# Altium project BraaiBuddyPCB.PrjPcb (part 1 of 2)
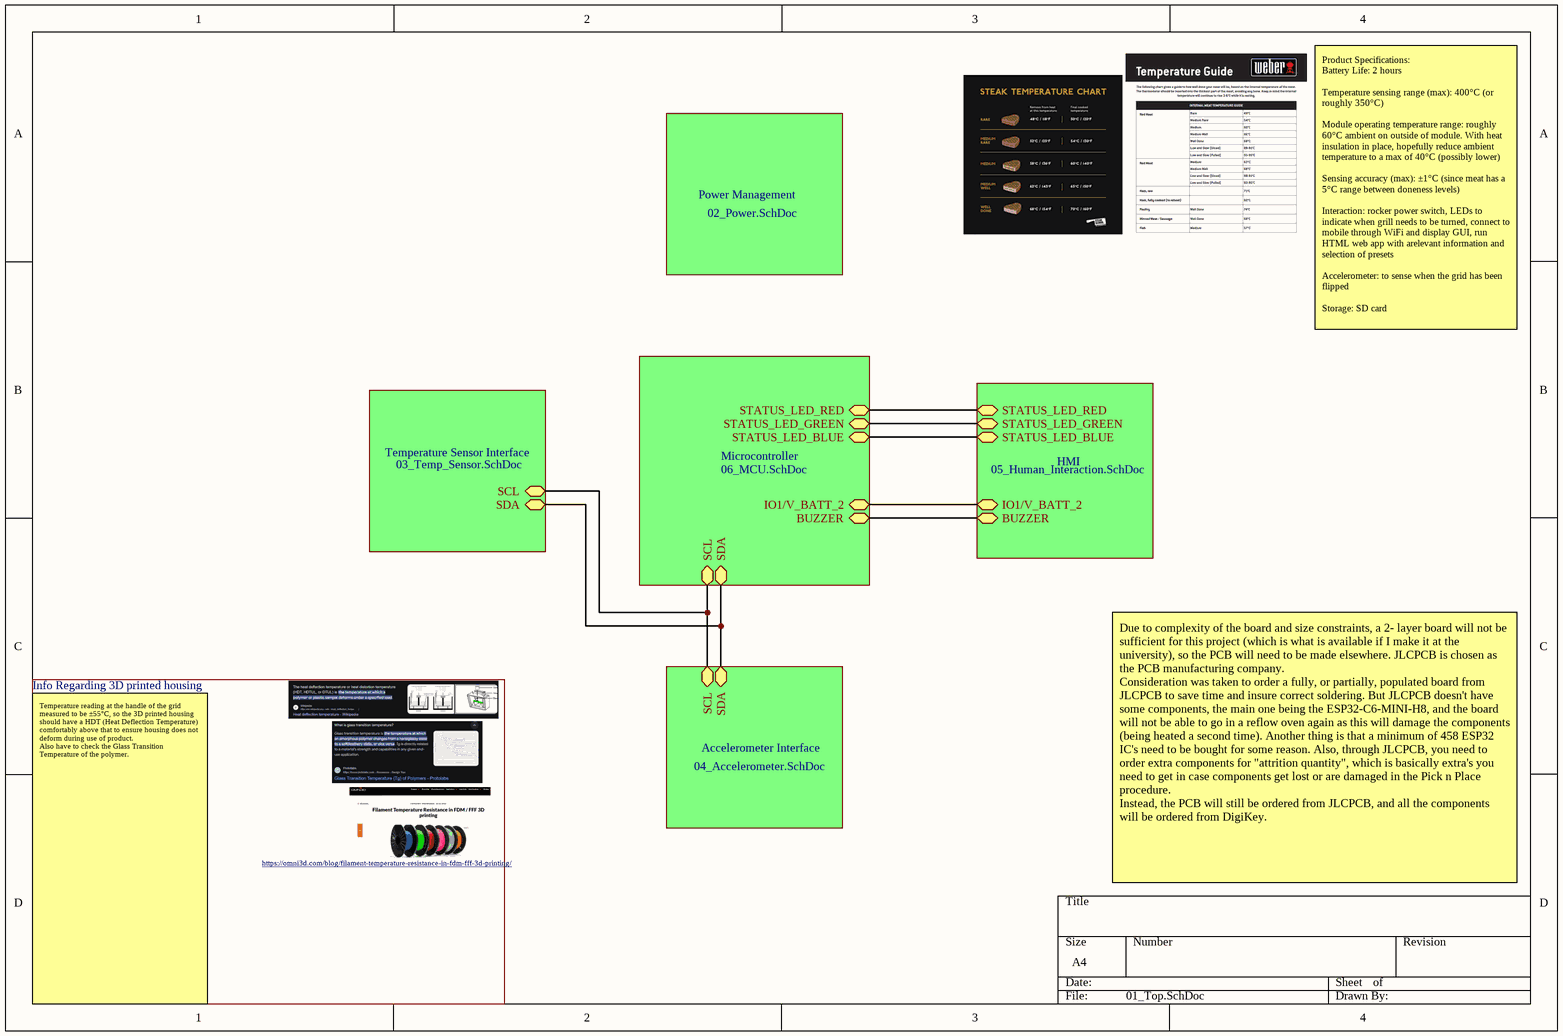
[diagram p0: 01_Top.SchDoc]
my_name: Estiaan Botha
9 sheets, 239 parts. Net scope: hierarchical (ports join the sheet entries above them; power ports are global).
Board file: PCB.PcbDoc
Sheets:
  01_Top.SchDoc
    Microcontroller = 06_MCU.SchDoc
    Temperature Sensor Interface = 03_Temp_Sensor.SchDoc
      U_04.1_Temp_Sensor_Info = 04.1_Temp_Sensor_Info.SchDoc
      Temp_Handling_ CH1 = 04.2_Thermocouple_Handling_01.SchDoc
      Temp_Handling_ CH2 = 04.2_Thermocouple_Handling_01.SchDoc
      Temp_Handling_ CH3 = 04.2_Thermocouple_Handling_01.SchDoc
      Temp_Handling_ CH4 = 04.2_Thermocouple_Handling_01.SchDoc
      Temp_Handling_ CH5 = 04.2_Thermocouple_Handling_01.SchDoc
    Accelerometer Interface = 04_Accelerometer.SchDoc
    Power Management = 02_Power.SchDoc
    HMI = 05_Human_Interaction.SchDoc
  Schematic.SchDoc
    Temp_Handling_ CH1 = 04.2_Thermocouple_Handling_01.SchDoc
    Temp_Handling_ CH2 = 04.2_Thermocouple_Handling_01.SchDoc
    Temp_Handling_ CH3 = 04.2_Thermocouple_Handling_01.SchDoc
    Temp_Handling_ CH4 = 04.2_Thermocouple_Handling_01.SchDoc
    Temp_Handling_ CH5 = 04.2_Thermocouple_Handling_01.SchDoc

## Sheet 01_Top.SchDoc
size A4; SheetNumber: 1; SheetTotal: 8

### Sub-sheets
Accelerometer Interface = 04_Accelerometer.SchDoc: SCL (bidir), SDA (bidir)
HMI = 05_Human_Interaction.SchDoc: STATUS_LED_RED (bidir), STATUS_LED_GREEN (bidir), STATUS_LED_BLUE (bidir), IO1/V_BATT_2 (bidir), BUZZER (bidir)
Microcontroller = 06_MCU.SchDoc: SCL (bidir), SDA (bidir), IO1/V_BATT_2 (bidir), STATUS_LED_RED (bidir), STATUS_LED_GREEN (bidir), STATUS_LED_BLUE (bidir), BUZZER (bidir)
Power Management = 02_Power.SchDoc: no entries
Temperature Sensor Interface = 03_Temp_Sensor.SchDoc: SCL (bidir), SDA (bidir)

### Nets
IO6/SDA: sheet Microcontroller/SDA, sheet Temperature Sensor Interface/SDA, sheet Accelerometer Interface/SDA
IO7/SCL: sheet Microcontroller/SCL, sheet Temperature Sensor Interface/SCL, sheet Accelerometer Interface/SCL
IO14: sheet Microcontroller/BUZZER, sheet HMI/BUZZER
NetR13#1_2: sheet Microcontroller/STATUS_LED_GREEN, sheet HMI/STATUS_LED_GREEN
NetR14#1_2: sheet Microcontroller/STATUS_LED_RED, sheet HMI/STATUS_LED_RED
NetR15#1_2: sheet Microcontroller/STATUS_LED_BLUE, sheet HMI/STATUS_LED_BLUE
NetR16#1_1: sheet Microcontroller/IO1/V_BATT_2, sheet HMI/IO1/V_BATT_2

### Notes on the sheet
- Product Specifications:
  Battery Life: 2 hours
  Temperature sensing range (max): 400°C (or roughly 350°C)
  Module operating temperature range: roughly 60°C ambient on outside of module. With heat insulation in place, hopefully reduce ambient temperature to a max of 40°C (possibly lower)
  Sensing accuracy (max): ±1°C (since meat has a 5°C range between doneness levels)
  Interaction: rocker power switch, LEDs to indicate when grill needs to be turned, connect to mobile through WiFi and display GUI, run HTML web app with arelevant information and selection of presets
  Accelerometer: to sense when the grid has been flipped
  Storage: SD card
- Info Regarding 3D printed housing
- https://omni3d.com/blog/filament-temperature-resistance-in-fdm-fff-3d-printing/
- Due to complexity of the board and size constraints, a 2- layer board will not be sufficient for this project (which is what is available if I make it at the university), so the PCB will need to be made elsewhere. JLCPCB is chosen as the PCB manufacturing company.
  Consideration was taken to order a fully, or partially, populated board from JLCPCB to save time and insure correct soldering. But JLCPCB doesn't have some components, the main one being the ESP32-C6-MINI-H8, and the board will not be able to go in a reflow oven again as this will damage the components (being heated a second time). Another thing is that a minimum of 458 ESP32 IC's need to be bought for some reason. Also, through JLCPCB, you need to order extra components for "attrition quantity", which is basically extra's you need to get in case components get lost or are damaged in the Pick n Place procedure.
  Instead, the PCB will still be ordered from JLCPCB, and all the components will be ordered from DigiKey.
- Temperature reading at the handle of the grid measured to be ±55°C, so the 3D printed housing should have a HDT (Heat Deflection Temperature) comfortably above that to ensure housing does not deform during use of product.
  Also have to check the Glass Transition Temperature of the polymer.

## Sheet 06_MCU.SchDoc
size 431 x 279 mm; Author: Estiaan Botha; SheetNumber: 8; SheetTotal: 9; ENG_APP_DATE: --/--/--; DSN_APP_DATE: --/--/--; CHK_APP_DATE: --/--/--
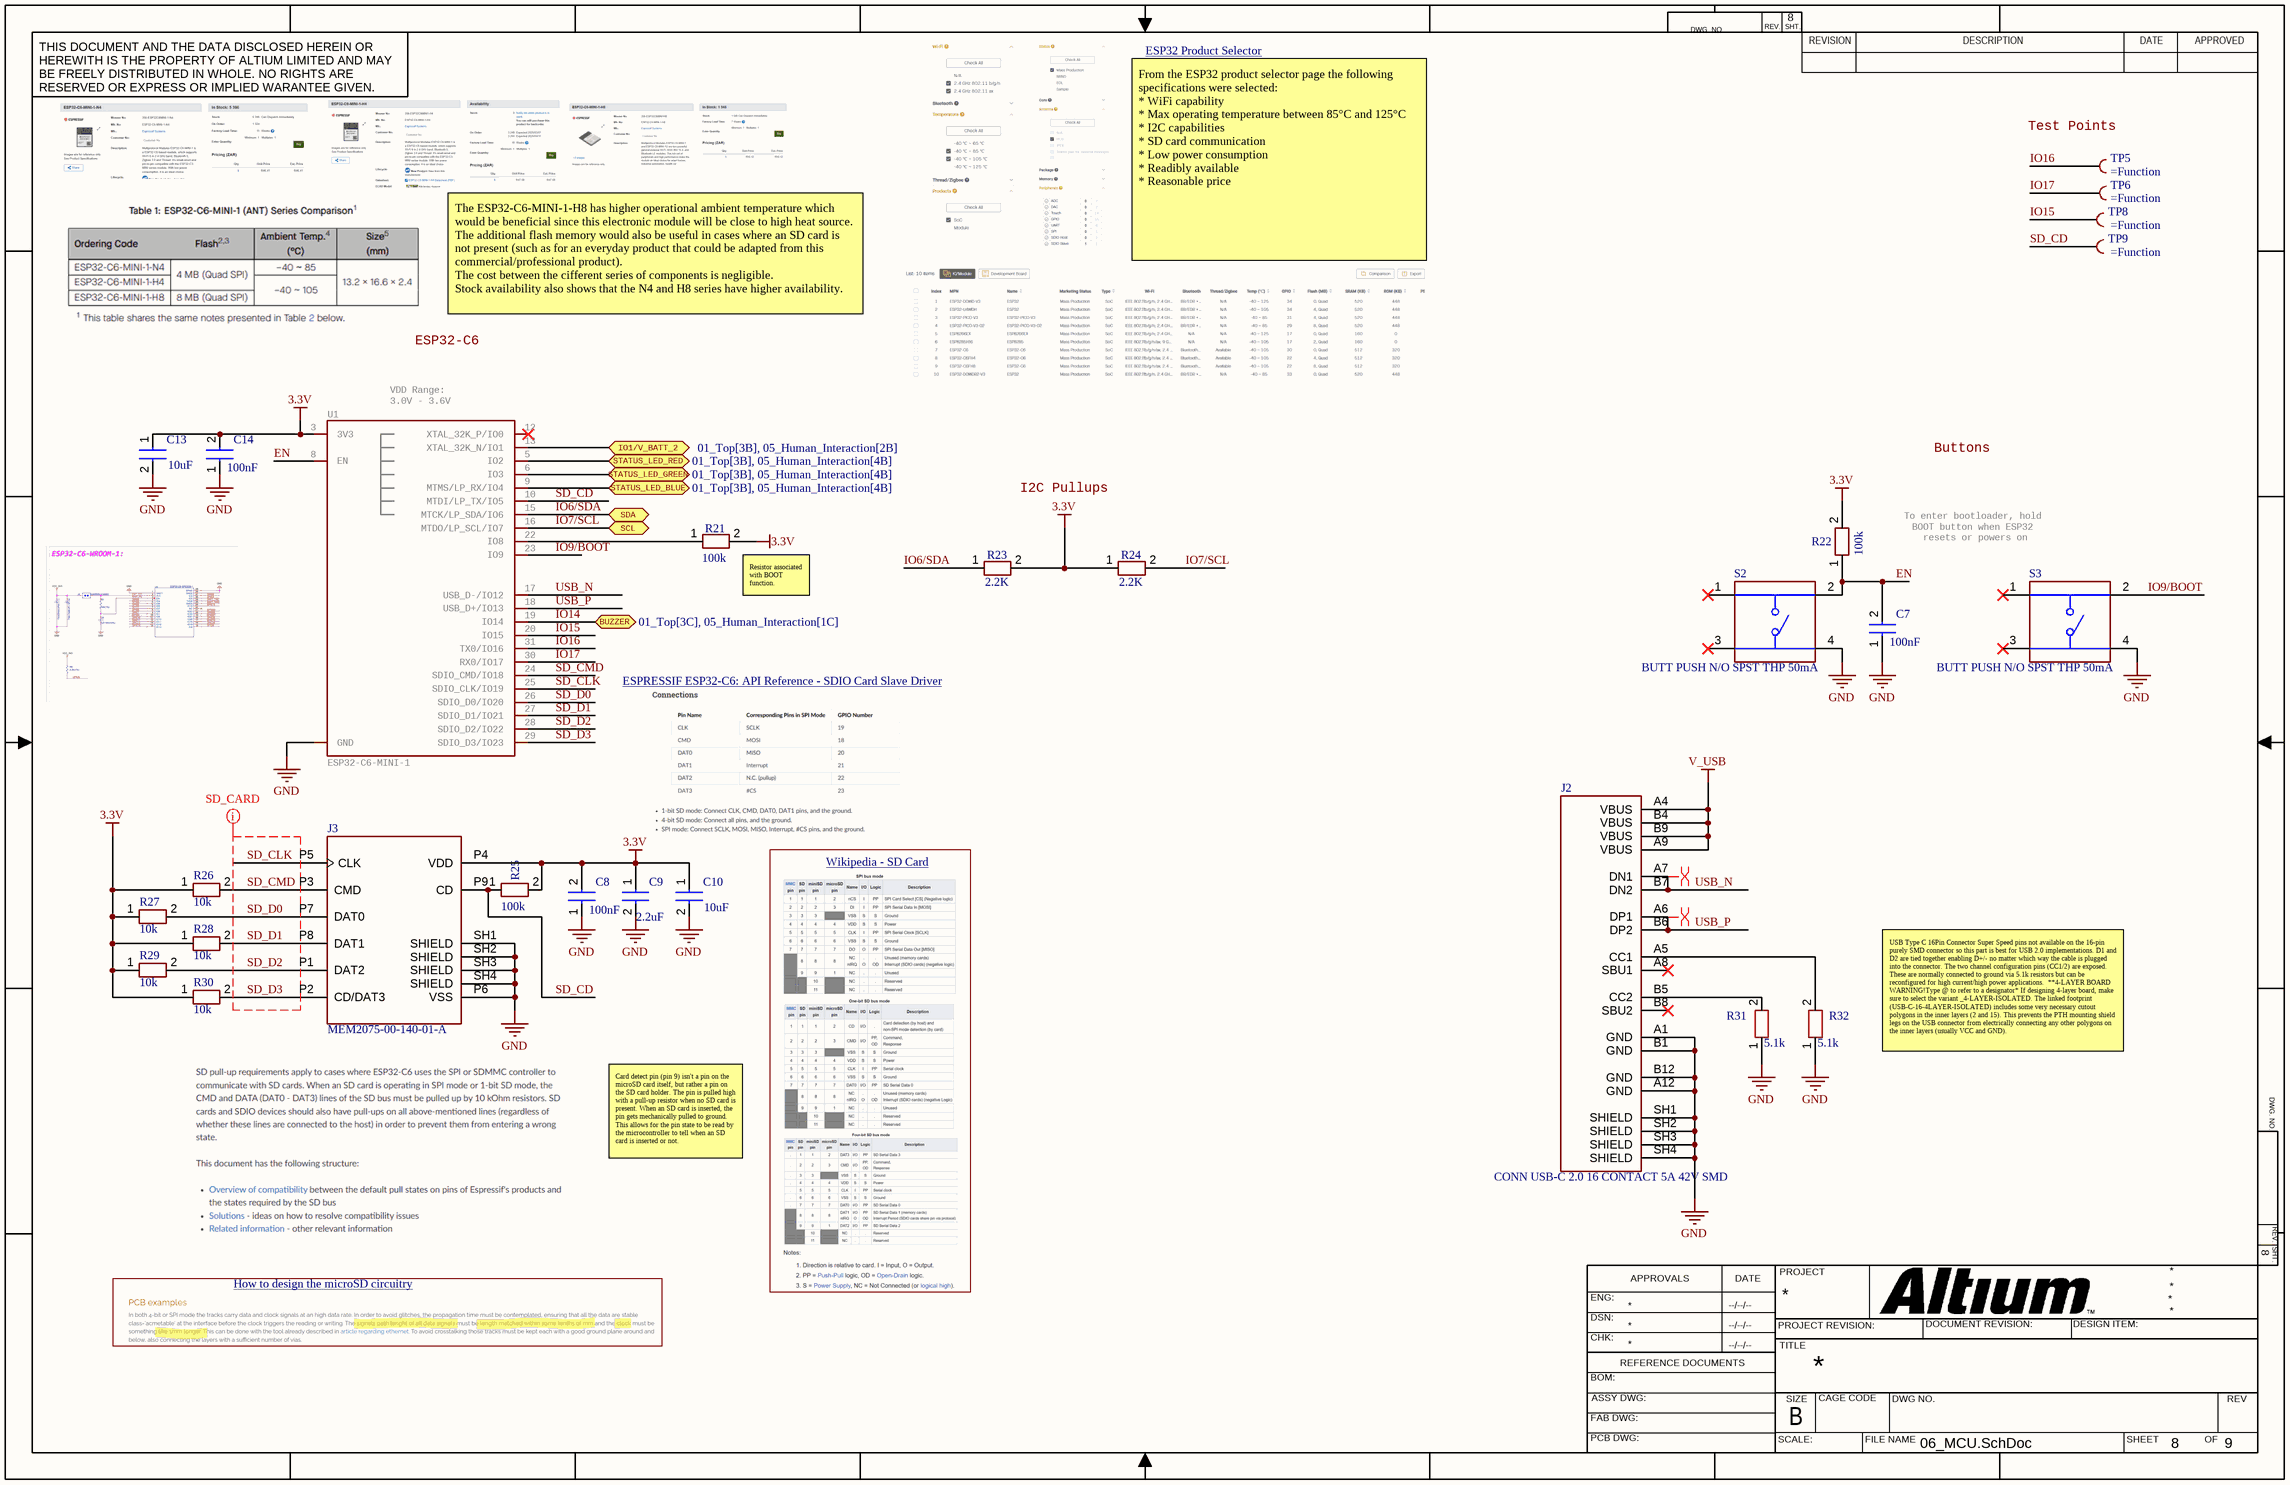
[diagram p1: 06_MCU.SchDoc]

### Parts
(Parts that share a designator on the sheet are numbered #1, #2 ... from top to bottom, then left to right.)
C7#1  100nF  [CAPC2012X94N]
C8#1  100nF  [CAPC2012X94N]
C9#1  2.2uF  [CAPC2012X135N]
C10#1  10uF  [CAPC2012X94N]
C13#1  10uF  [CAPC2012X94N]
C14#1  100nF  [CAPC2012X94N]
J2#1  CONN USB-C 2.0 16 CONTACT 5A 42V SMD  [CUI_UJ20-C-H-G-SMT-TR]
J3#1  MEM2075-00-140-01-A  [GCT_MEM2075-00-140-01-A]
R21#1  100k  [RESC2012X50N]
R22#1  100k  [RESC2012X50N]
R23#1  2.2K  [RESC2012X70N]
R24#1  2.2K  [RESC2012X70N]
R25#1  100k  [RESC2012X50N]
R26#1  10k  [RESC2012X60N]
R27#1  10k  [RESC2012X60N]
R28#1  10k  [RESC2012X60N]
R29#1  10k  [RESC2012X60N]
R30#1  10k  [RESC2012X60N]
R31#1  5.1k  [RESC2012X60N]
R32#1  5.1k  [RESC2012X60N]
S2#1  BUTT PUSH N/O SPST THP 50mA  [SW_TS02-66-43-BK-100-LCR-D]
S3#1  BUTT PUSH N/O SPST THP 50mA  [SW_TS02-66-43-BK-100-LCR-D]
TP5#1  (no value)  [TP_Pad_TH_1.2P_0.6H]  (no BOM)
TP6#1  (no value)  [TP_Pad_TH_1.2P_0.6H]  (no BOM)
TP8#1  (no value)  [TP_Pad_TH_1.2P_0.6H]  (no BOM)
TP9#1  (no value)  [TP_Pad_TH_1.2P_0.6H]  (no BOM)
U1#1  ESP32-C6-MINI-1  [ESP32C6MINI1H8]

### Ports
BUZZER (bidir, see 01_Top[3C], 05_Human_Interaction[1C]), IO1/V_BATT_2 (bidir, see 01_Top[3B], 05_Human_Interaction[2B]), SCL (bidir, see 01_Top[2C], 03_Temp_Sensor[4B], 04.2_Thermocouple_Handling_01[2B], 04_Accelerometer[3B]), SDA (bidir, see 01_Top[2C], 03_Temp_Sensor[4B], 04.2_Thermocouple_Handling_01[2B], 04_Accelerometer[3C]), STATUS_LED_BLUE (bidir, see 01_Top[3B], 05_Human_Interaction[4B]), STATUS_LED_GREEN (bidir, see 01_Top[3B], 05_Human_Interaction[4B]), STATUS_LED_RED (bidir, see 01_Top[3B], 05_Human_Interaction[4B])

### Nets
3.3V: C8#1.2 C9#1.1 C10#1.1 C13#1.1 C14#1.2 J3#1.P4(VDD) R21#1.2 R22#1.2 R23#1.2 R24#1.1 R25#1.2 R26#1.1 R27#1.1 R28#1.1 R29#1.1 R30#1.1 U1#1.3(3V3)
GND: C7#1.1 C8#1.1 C9#1.2 C10#1.2 C13#1.2 C14#1.1 J2#1.A1(GND) J2#1.A12(GND) J2#1.B1(GND) J2#1.B12(GND) J2#1.SH1(SHIELD) J2#1.SH2(SHIELD) J2#1.SH3(SHIELD) J2#1.SH4(SHIELD) J3#1.P6(VSS) J3#1.SH1(SHIELD) J3#1.SH2(SHIELD) J3#1.SH3(SHIELD) J3#1.SH4(SHIELD) R31#1.1 R32#1.1 S2#1.4 S3#1.4 U1#1.1(GND)
V_USB: J2#1.A4(VBUS) J2#1.A9(VBUS) J2#1.B4(VBUS) J2#1.B9(VBUS)
EN: C7#1.2 R22#1.1 S2#1.2 U1#1.8(EN)
IO6/SDA: R23#1.1 U1#1.15(MTCK/LP_SDA/IO6) ; port SDA
IO7/SCL: R24#1.2 U1#1.16(MTDO/LP_SCL/IO7) ; port SCL
IO9/BOOT: S3#1.2 U1#1.23(IO9)
IO14: U1#1.19(IO14) ; port BUZZER
IO15: TP8#1.TP U1#1.20(IO15)
IO16: TP5#1.TP U1#1.31(TX0/IO16)
IO17: TP6#1.TP U1#1.30(RX0/IO17)
SD_CD: J3#1.P9(CD) R25#1.1 TP9#1.TP U1#1.10(MTDI/LP_TX/IO5)
SD_CLK: J3#1.P5(CLK) U1#1.25(SDIO_CLK/IO19)
SD_CMD: J3#1.P3(CMD) R26#1.2 U1#1.24(SDIO_CMD/IO18)
SD_D0: J3#1.P7(DAT0) R27#1.2 U1#1.26(SDIO_D0/IO20)
SD_D1: J3#1.P8(DAT1) R28#1.2 U1#1.27(SDIO_D1/IO21)
SD_D2: J3#1.P1(DAT2) R29#1.2 U1#1.28(SDIO_D2/IO22)
SD_D3: J3#1.P2(CD/DAT3) R30#1.2 U1#1.29(SDIO_D3/IO23)
USB_N: J2#1.A7(DN1) J2#1.B7(DN2) U1#1.17(USB_D-/IO12)
USB_P: J2#1.A6(DP1) J2#1.B6(DP2) U1#1.18(USB_D+/IO13)
NetJ2#1_A5: J2#1.A5(CC1) R32#1.2
NetJ2#1_B5: J2#1.B5(CC2) R31#1.2
NetR13#1_2: U1#1.6(IO3) ; port STATUS_LED_GREEN
NetR14#1_2: U1#1.5(IO2) ; port STATUS_LED_RED
NetR15#1_2: U1#1.9(MTMS/LP_RX/IO4) ; port STATUS_LED_BLUE
NetR16#1_1: U1#1.13(XTAL_32K_N/IO1) ; port IO1/V_BATT_2
NetR21#1_1: R21#1.1 U1#1.22(IO8)

Not connected (* = marked no-connect by the designer): J2#1 A8(SBU1)* B8(SBU2)*; S2#1 1* 3*; S3#1 1* 3*; U1#1 12(XTAL_32K_P/IO0)*

### Layout directives
differential pair: USB_N, USB_P
net class SD Card: SD_CLK, SD_CMD, SD_D0, SD_D1, SD_D2, SD_D3

### Notes on the sheet
- ESP32 Product Selector <https://products.espressif.com/#/product-selector?names=>
- (near TP5#1) Test Points
- From the ESP32 product selector page the following specifications were selected:
  * WiFi capability
  * Max operating temperature between 85°C and 125°C
  * I2C capabilities
  * SD card communication
  * Low power consumption
  * Readibly available
  * Reasonable price
- ESP32-C6
- The ESP32-C6-MINI-1-H8 has higher operational ambient temperature which would be beneficial since this electronic module will be close to high heat source. The additional flash memory would also be useful in cases where an SD card is not present (such as for an everyday product that could be adapted from this commercial/professional product).
  The cost between the cifferent series of components is negligible.
  Stock availability also shows that the N4 and H8 series have higher availability.
- (near U1#1) VDD Range:
  3.0V - 3.6V
- I2C Pullups
- Buttons
- To enter bootloader, hold
  BOOT button when ESP32
  resets or powers on
- (near R21#1) Resistor associated with BOOT function.
- ESPRESSIF ESP32-C6: API Reference - SDIO Card Slave Driver <https://docs.espressif.com/projects/esp-idf/en/v5.2.4/esp32c6/api-reference/peripherals/sdio_slave.html>
- Wikipedia - SD Card <https://en.wikipedia.org/wiki/SD_card#Technical_details>
- USB Type C 16Pin Connector Super Speed pins not available on the 16-pin purely SMD connector so this part is best for USB 2.0 implementations. D1 and D2 are tied together enabling D+/- no matter which way the cable is plugged into the connector. The two channel configuration pins (CC1/2) are exposed. These are normally connected to ground via 5.1k resistors but can be reconfigured for high current/high power applications.  **4-LAYER BOARD WARNING!Type @ to refer to a designator* If designing 4-layer board, make sure to select the variant _4-LAYER-ISOLATED. The linked footprint (USB-C-16-4LAYER-ISOLATED) includes some very necessary cutout polygons in the inner layers (2 and 15). This prevents the PTH mounting shield legs on the USB connector from electrically connecting any other polygons on the inner layers (usually VCC and GND).
- Card detect pin (pin 9) isn't a pin on the microSD card itself, but rather a pin on the SD card holder. The pin is pulled high with a pull-up resistor when no SD card is present. When an SD card is inserted, the pin gets mechanically pulled to ground. This allows for the pin state to be read by the microcontroller to tell when an SD card is inserted or not.
- How to design the microSD circuitry <https://www.acmesystems.it/pcb_microsd>
- DWG. NO.
- REV.
- SHT.
- THIS DOCUMENT AND THE DATA DISCLOSED HEREIN OR HEREWITH IS THE PROPERTY OF ALTIUM LIMITED AND MAY BE FREELY DISTRIBUTED IN WHOLE. NO RIGHTS ARE RESERVED OR EXPRESS OR IMPLIED WARANTEE GIVEN.
- REVISION
- DESCRIPTION
- DATE
- APPROVED
- ENG:
- APPROVALS
- PROJECT
- DSN:
- CHK:
- REFERENCE DOCUMENTS
- PROJECT REVISION:
- TITLE
- DOCUMENT REVISION:
- DESIGN ITEM:
- BOM:
- FAB DWG:
- PCB DWG:
- ASSY DWG:
- SCALE:
- SIZE
- B
- CAGE CODE
- FILE NAME
- DWG NO.
- SHEET
- OF
- REV

### Library data of the parts
C7#1 C8#1 C14#1 = CAP CER 100nF 0805 SMD: Capacitor; Manufacturer_Part_Number: 08055C104KAZ2A; ComponentLink1Description: Datasheet; ComponentLink1URL: http://datasheets.avx.com/X7RDielectric.pdf
C9#1 = CAP CER 2u2F 0805 SMD: Capacitor; Manufacturer_Part_Number: LMK212BJ225MG-T
C10#1 C13#1 = CAP CER 10uF 0805 SMD: Capacitor; Manufacturer_Part_Number: CL21A106KOQNNNE; ComponentLink1Description: Datasheet; ComponentLink1URL: https://www.mouser.co.za/datasheet/2/585/MLCC-1837944.pdf
J2#1 = CONN USB-C 2.0 16 CONTACT 5A 42V SMD: USB Connectors Type C,2.0, Horizontal, Gold plated 3u, Mid Surface Mount 1.0mm, 16 pin, T&R; Manufacturer_Part_Number: UJ20-C-H-G-SMT-TR; ComponentLink1Description: Datasheet; ComponentLink1URL: https://www.sameskydevices.com/product/resource/uj20-c-h-g-smt-tr.pdf
J3#1 = SD CARD SOCKET SMD MEM2075-00-140-01-A: 9 (8 + 1) Position Card Connector microSD Surface Mount, Right Angle Gold; ComponentLink1Description: Datasheet; ComponentLink1URL: https://www.mouser.co.za/datasheet/2/837/MEM2075-2887971.pdf; Manufacturer_Part_Number: MEM2075-00-140-01-A
R21#1 R22#1 R25#1 = RES 100K 0805 SMD: Resistor; Manufacturer_Part_Number: CRCW0805100KJNECC
R23#1 R24#1 = RES 2.2K 0805 SMD: Resistor; Manufacturer_Part_Number: ERJ-PB6B2201V
R26#1 R27#1 R28#1 R29#1 R30#1 = RES 10K 0805 SMD: Resistor; Manufacturer_Part_Number: CR0805-FX-1002ELF
R31#1 R32#1 = RES 5.1K 0805 SMD: Resistor; Manufacturer_Part_Number: RC0805JR-075K1L; ComponentLink1Description: Datasheet; ComponentLink1URL: https://industrial.panasonic.com/cdbs/www-data/pdf/RDA0000/AOA0000C84.pdf
S2#1 S3#1 = BUTT PUSH N/O SPST THP 50mA: 6 x 6 mm, 4.3 mm Actuator Height, 100 gf, Black, Long Crimped, Through Hole, SPST, Tactile Switch; Manufacturer_Part_Number: TS02-66-43-BK-100-LCR-D
TP5#1 TP6#1 TP8#1 TP9#1 = TP 1.5mm PAD
U1#1 = ESP32-C6-MINI-1: Manufacturer_Part_Number: ESP32-C6-MINI-1-H8; ComponentLink1Description: Datasheet; ComponentLink1URL: https://www.mouser.com/catalog/specsheets/Espressif_Systems_esp32-c6-mini-1_mini-1u_datasheet_en.pdf?_gl=1*7278yr*_gcl_aw*R0NMLjE3Mzk0MzM2MTQuQ2p3S0NBaUFxckc5QmhBVkVpd0FhUHU1emlsTWRuRXdaa2Fsd2VWNEN5MzNjMjVBX1BkRDhocTJZbnRtek0tckw4Q0pVVXJTcmNRbGdob0NCcXNRQXZEX0J3RQ..*_gcl_au*ODgyNzE3NTQxLjE3NDEwOTkzMzU.*_ga*MjEzMDEzNzc2Mi4xNzMzMzA0NDkw*_ga_15W4STQT4T*MTc0MTUxNTkxNS42MC4xLjE3NDE1MTgwNDEuMzcuMC4w

## Sheet 03_Temp_Sensor.SchDoc
size A4; SheetNumber: 3; SheetTotal: 9
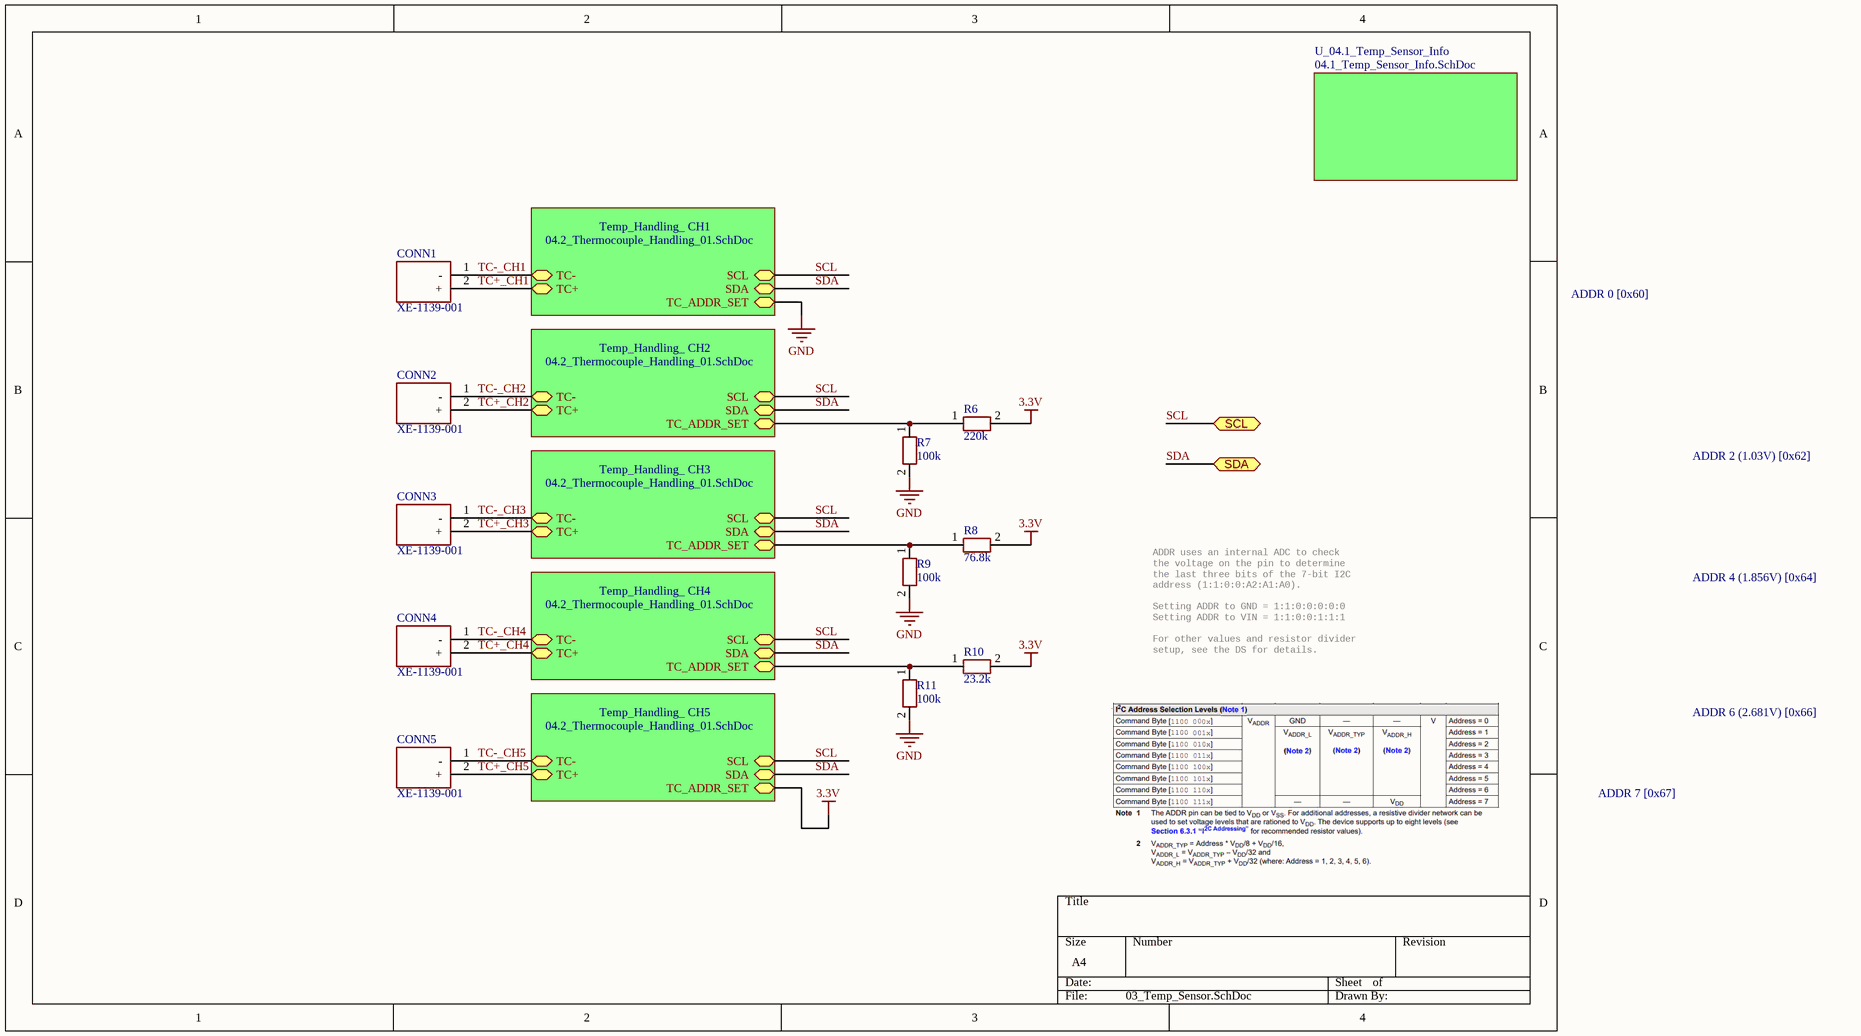
[diagram p2: 03_Temp_Sensor.SchDoc]

### Parts
(Parts that share a designator on the sheet are numbered #1, #2 ... from top to bottom, then left to right.)
CONN1#1  XE-1139-001  [AM-K PCB XE-1139-001]
CONN2#1  XE-1139-001  [AM-K PCB XE-1139-001]
CONN3#1  XE-1139-001  [AM-K PCB XE-1139-001]
CONN4#1  XE-1139-001  [AM-K PCB XE-1139-001]
CONN5#1  XE-1139-001  [AM-K PCB XE-1139-001]
R6#1  220k  [RESC2012X60N]
R7#1  100k  [RESC2012X50N]
R8#1  76.8k  [RESC2012X60N]
R9#1  100k  [RESC2012X50N]
R10#1  23.2k  [RESC2012X60N]
R11#1  100k  [RESC2012X50N]

### Sub-sheets
Temp_Handling_ CH1 = 04.2_Thermocouple_Handling_01.SchDoc: TC+ (bidir), TC- (bidir), SCL (bidir), SDA (bidir), TC_ADDR_SET (bidir)
Temp_Handling_ CH2 = 04.2_Thermocouple_Handling_01.SchDoc: TC+ (bidir), TC- (bidir), SCL (bidir), SDA (bidir), TC_ADDR_SET (bidir)
Temp_Handling_ CH3 = 04.2_Thermocouple_Handling_01.SchDoc: TC+ (bidir), TC- (bidir), SCL (bidir), SDA (bidir), TC_ADDR_SET (bidir)
Temp_Handling_ CH4 = 04.2_Thermocouple_Handling_01.SchDoc: TC+ (bidir), TC- (bidir), SCL (bidir), SDA (bidir), TC_ADDR_SET (bidir)
Temp_Handling_ CH5 = 04.2_Thermocouple_Handling_01.SchDoc: TC+ (bidir), TC- (bidir), SCL (bidir), SDA (bidir), TC_ADDR_SET (bidir)
U_04.1_Temp_Sensor_Info = 04.1_Temp_Sensor_Info.SchDoc: no entries

### Ports
SCL (bidir, see 01_Top[2B], 04.2_Thermocouple_Handling_01[2B], 04_Accelerometer[3B], 06_MCU[6D]), SDA (bidir, see 01_Top[2B], 04.2_Thermocouple_Handling_01[2B], 04_Accelerometer[3C], 06_MCU[6D])

### Nets
3.3V: R6#1.2 R8#1.2 R10#1.2 ; sheet Temp_Handling_ CH5/TC_ADDR_SET
GND: R7#1.2 R9#1.2 R11#1.2 ; sheet Temp_Handling_ CH1/TC_ADDR_SET
SCL: port SCL, sheet Temp_Handling_ CH1/SCL, sheet Temp_Handling_ CH2/SCL, sheet Temp_Handling_ CH3/SCL, sheet Temp_Handling_ CH4/SCL, sheet Temp_Handling_ CH5/SCL  [project net IO7/SCL]
SDA: port SDA, sheet Temp_Handling_ CH1/SDA, sheet Temp_Handling_ CH2/SDA, sheet Temp_Handling_ CH3/SDA, sheet Temp_Handling_ CH4/SDA, sheet Temp_Handling_ CH5/SDA  [project net IO6/SDA]
TC+_CH1: CONN1#1.2(+) ; sheet Temp_Handling_ CH1/TC+
TC+_CH2: CONN2#1.2(+) ; sheet Temp_Handling_ CH2/TC+
TC+_CH3: CONN3#1.2(+) ; sheet Temp_Handling_ CH3/TC+
TC+_CH4: CONN4#1.2(+) ; sheet Temp_Handling_ CH4/TC+
TC+_CH5: CONN5#1.2(+) ; sheet Temp_Handling_ CH5/TC+
TC-_CH1: CONN1#1.1(-) ; sheet Temp_Handling_ CH1/TC-
TC-_CH2: CONN2#1.1(-) ; sheet Temp_Handling_ CH2/TC-
TC-_CH3: CONN3#1.1(-) ; sheet Temp_Handling_ CH3/TC-
TC-_CH4: CONN4#1.1(-) ; sheet Temp_Handling_ CH4/TC-
TC-_CH5: CONN5#1.1(-) ; sheet Temp_Handling_ CH5/TC-
NetR6#1_1: R6#1.1 R7#1.1 ; sheet Temp_Handling_ CH2/TC_ADDR_SET
NetR8#1_1: R8#1.1 R9#1.1 ; sheet Temp_Handling_ CH3/TC_ADDR_SET
NetR10#1_1: R10#1.1 R11#1.1 ; sheet Temp_Handling_ CH4/TC_ADDR_SET

### Notes on the sheet
- ADDR 0 [0x60]
- ADDR 2 (1.03V) [0x62]
- ADDR 4 (1.856V) [0x64]
- ADDR uses an internal ADC to check
  the voltage on the pin to determine
  the last three bits of the 7-bit I2C
  address (1:1:0:0:A2:A1:A0).
  Setting ADDR to GND = 1:1:0:0:0:0:0
  Setting ADDR to VIN = 1:1:0:0:1:1:1
  For other values and resistor divider
  setup, see the DS for details.
- ADDR 6 (2.681V) [0x66]
- ADDR 7 [0x67]

### Library data of the parts
CONN1#1 CONN2#1 CONN3#1 CONN4#1 CONN5#1 = CONN AM-K-PCB XE-1139-001: Thermocouple Type-K Connector; Manufacturer_Part_Number: XE-1139-001; Supplier: DigiKey; ComponentLink1Description: Datasheet; ComponentLink1URL: https://mm.digikey.com/Volume0/opasdata/d220001/medias/docus/6465/XE-1139-001.pdf
R6#1 = RES 220K 0805 SMD: Resistor; Manufacturer_Part_Number: CR0805-FX-2203ELF
R7#1 R9#1 R11#1 = RES 100K 0805 SMD: as R21#1 on sheet 06_MCU
R8#1 = RES 76.8K 0805 SMD: Resistor; Manufacturer_Part_Number: RC0805FR-0776K8L; ComponentLink1Description: Datasheet; ComponentLink1URL: https://industrial.panasonic.com/cdbs/www-data/pdf/RDA0000/AOA0000C84.pdf
R10#1 = RES 23.2K 0805 SMD: Resistor; Manufacturer_Part_Number: RC0805FR-0723K2L; ComponentLink1Description: Datasheet; ComponentLink1URL: https://industrial.panasonic.com/cdbs/www-data/pdf/RDA0000/AOA0000C84.pdf

## Sheet 04.1_Temp_Sensor_Info.SchDoc
size A4; SheetNumber: 4; SheetTotal: 8
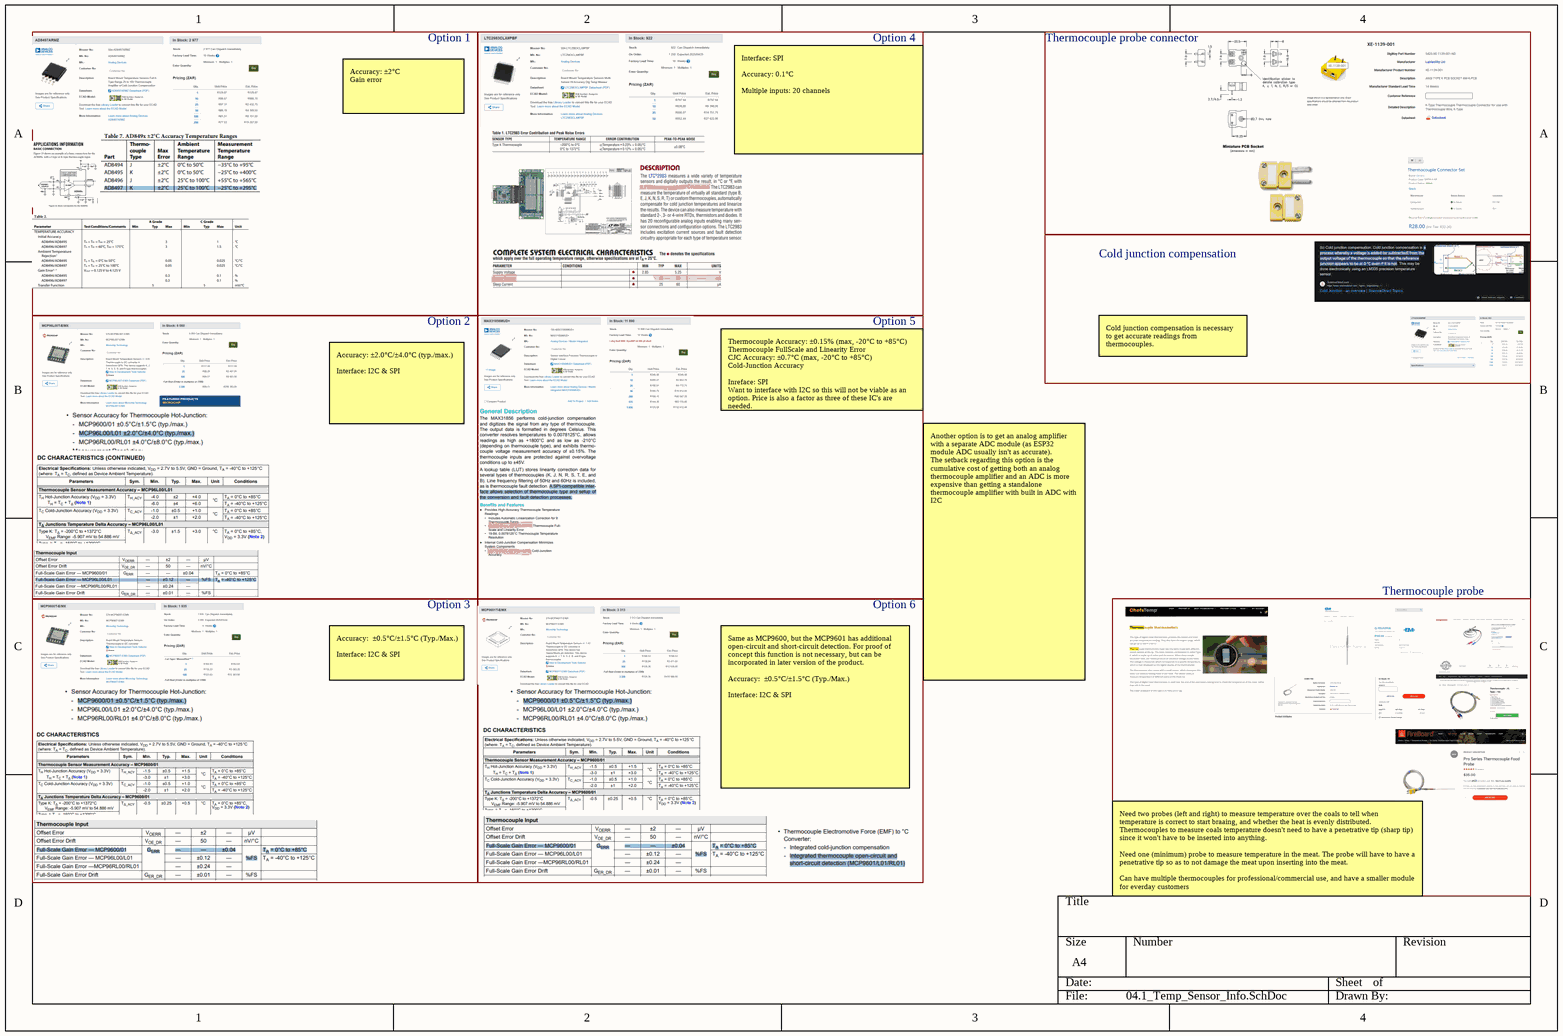
[diagram p3: 04.1_Temp_Sensor_Info.SchDoc]

### Notes on the sheet
- Option 1
- Option 4
- Thermocouple probe connector
- Accuracy: ±2°C
  Gain error
- Interface: SPI
  Accuracy: 0.1°C
  Multiple inputs: 20 channels
- Cold junction compensation
- Option 2
- Option 5
- Cold junction compensation is necessary to get accurate readings from thermocouples.
- Accuracy: ±2.0°C/±4.0°C (typ./max.)
  Interface: I2C & SPI
- Thermocouple Accuracy: ±0.15% (max, -20°C to +85°C) Thermocouple FullScale and Linearity Error
  CJC Accuracy: ±0.7°C (max, -20°C to +85°C) Cold-Junction Accuracy
  Inreface: SPI
  Want to interface with I2C so this will not be viable as an option. Price is also a factor as three of these IC's are needed.
- Option 3
- Option 6
- Thermocouple probe
- Accuracy:  ±0.5°C/±1.5°C (Typ./Max.)
  Interface: I2C & SPI
- Another option is to get an analog amplifier with a separate ADC module (as ESP32 module ADC usually isn't as accurate).
  The setback regarding this option is the cumulative cost of getting both an analog thermocouple amplifier and an ADC is more expensive than getting a standalone thermocouple amplifier with built in ADC with I2C
- Same as MCP9600, but the MCP9601 has additional open-circuit and short-circuit detection. For proof of concept this function is not necessary, but can be incorporated in later version of the product.
  Accuracy:  ±0.5°C/±1.5°C (Typ./Max.)
  Interface: I2C & SPI
- Need two probes (left and right) to measure temperature over the coals to tell when temperature is correct to start braaing, and whether the heat is evenly distributed. Thermocouples to measure coals temperature doesn't need to have a penetrative tip (sharp tip) since it won't have to be inserted into anything.
  Need one (minimum) probe to measure temperature in the meat. The probe will have to have a penetrative tip so as to not damage the meat upon inserting into the meat.
  Can have multiple thermocouples for professional/commercial use, and have a smaller module for everday customers

## Sheet 04.2_Thermocouple_Handling_01.SchDoc
size A4; SheetNumber: 5; SheetTotal: 8
Used 10 times, as channels Temperature Sensor Interface/Temp_Handling_ CH1, Temperature Sensor Interface/Temp_Handling_ CH2, Temperature Sensor Interface/Temp_Handling_ CH3, Temperature Sensor Interface/Temp_Handling_ CH4, Temperature Sensor Interface/Temp_Handling_ CH5, Temp_Handling_ CH1, Temp_Handling_ CH2, Temp_Handling_ CH3, Temp_Handling_ CH4, Temp_Handling_ CH5. Parts and nets are listed once, with the designators drawn on the sheet.
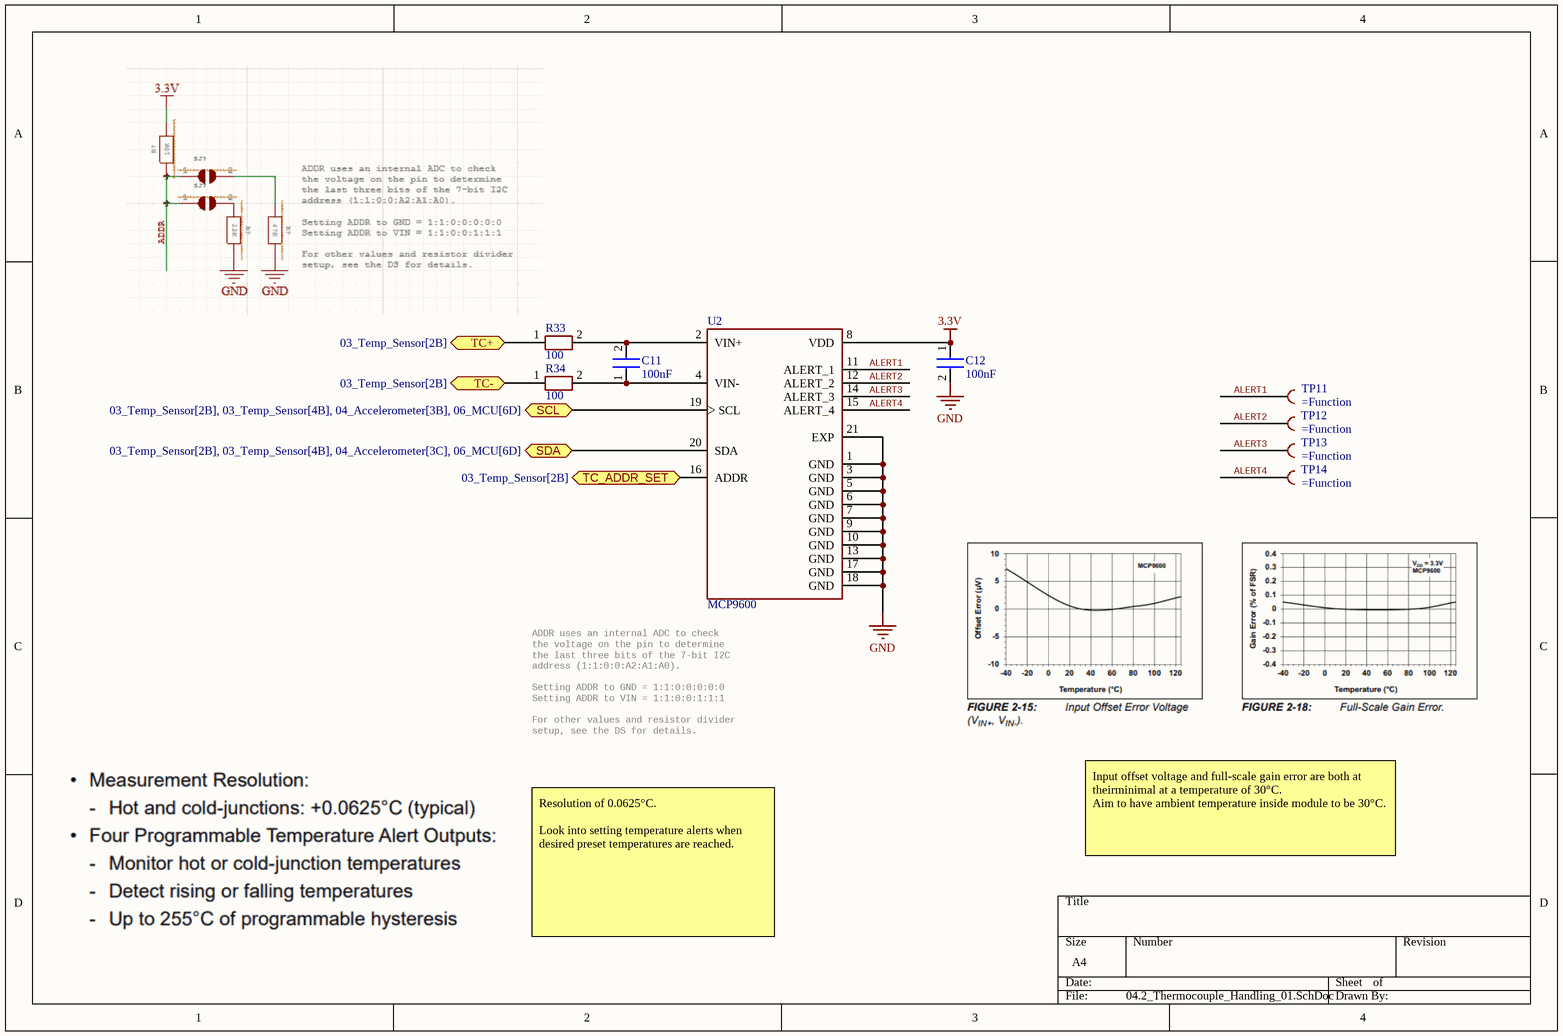
[diagram p4: 04.2_Thermocouple_Handling_01.SchDoc]

### Parts
C11  100nF  [CAPC2012X94N]
C12  100nF  [CAPC2012X94N]
R33  100  [RESC2012X60N]
R34  100  [RESC2012X60N]
TP11  (no value)  [TP_Pad_TH_1.2P_0.6H]  (no BOM)
TP12  (no value)  [TP_Pad_TH_1.2P_0.6H]  (no BOM)
TP13  (no value)  [TP_Pad_TH_1.2P_0.6H]  (no BOM)
TP14  (no value)  [TP_Pad_TH_1.2P_0.6H]  (no BOM)
U2  MCP9600  [QFN65P500X500X100-21N]

### Ports
SCL (bidir, see 03_Temp_Sensor[2B], 03_Temp_Sensor[4B], 04_Accelerometer[3B], 06_MCU[6D]), SDA (bidir, see 03_Temp_Sensor[2B], 03_Temp_Sensor[4B], 04_Accelerometer[3C], 06_MCU[6D]), TC+ (bidir, see 03_Temp_Sensor[2B]), TC- (bidir, see 03_Temp_Sensor[2B]), TC_ADDR_SET (bidir, see 03_Temp_Sensor[2B])

### Nets
3.3V: C12.1 U2.8(VDD)
GND: C12.2 U2.1(GND) U2.3(GND) U2.5(GND) U2.6(GND) U2.7(GND) U2.9(GND) U2.10(GND) U2.13(GND) U2.17(GND) U2.18(GND) U2.21(EXP)
ALERT1: TP11.TP U2.11(ALERT_1)
ALERT2: TP12.TP U2.12(ALERT_2)
ALERT3: TP13.TP U2.14(ALERT_3)
ALERT4: TP14.TP U2.15(ALERT_4)
SCL: U2.19(SCL) ; port SCL
SDA: U2.20(SDA) ; port SDA
TC+: R33.1 ; port TC+
TC-: R34.1 ; port TC-
TC_ADDR_SET: U2.16(ADDR) ; port TC_ADDR_SET
NetC11_1: C11.1 R34.2 U2.4(VIN-)
NetC11_2: C11.2 R33.2 U2.2(VIN+)

### Channels
Temperature Sensor Interface/Temp_Handling_ CH1: designators end in .1; ports SCL=IO7/SCL SDA=IO6/SDA TC+=TC+_CH1 TC-=TC-_CH1 TC_ADDR_SET=GND
Temperature Sensor Interface/Temp_Handling_ CH2: designators end in .2; ports SCL=IO7/SCL SDA=IO6/SDA TC+=TC+_CH2 TC-=TC-_CH2 TC_ADDR_SET=NetR6#1_1
Temperature Sensor Interface/Temp_Handling_ CH3: designators end in .3; ports SCL=IO7/SCL SDA=IO6/SDA TC+=TC+_CH3 TC-=TC-_CH3 TC_ADDR_SET=NetR8#1_1
Temperature Sensor Interface/Temp_Handling_ CH4: designators end in .4; ports SCL=IO7/SCL SDA=IO6/SDA TC+=TC+_CH4 TC-=TC-_CH4 TC_ADDR_SET=NetR10#1_1
Temperature Sensor Interface/Temp_Handling_ CH5: designators end in .5; ports SCL=IO7/SCL SDA=IO6/SDA TC+=TC+_CH5 TC-=TC-_CH5 TC_ADDR_SET=3.3V
Temp_Handling_ CH1: designators end in .6; ports SCL=SCL SDA=SDA TC+=TC+_CH1 TC-=TC-_CH1 TC_ADDR_SET=GND
Temp_Handling_ CH2: designators end in .7; ports SCL=SCL SDA=SDA TC+=TC+_CH2 TC-=TC-_CH2 TC_ADDR_SET=NetR6#2_1
Temp_Handling_ CH3: designators end in .8; ports SCL=SCL SDA=SDA TC+=TC+_CH3 TC-=TC-_CH3 TC_ADDR_SET=NetR8#2_1
Temp_Handling_ CH4: designators end in .9; ports SCL=SCL SDA=SDA TC+=TC+_CH4 TC-=TC-_CH4 TC_ADDR_SET=NetR10#2_1
Temp_Handling_ CH5: designators end in .10; ports SCL=SCL SDA=SDA TC+=TC+_CH5 TC-=TC-_CH5 TC_ADDR_SET=3.3V

### Notes on the sheet
- (near U2) ADDR uses an internal ADC to check
  the voltage on the pin to determine
  the last three bits of the 7-bit I2C
  address (1:1:0:0:A2:A1:A0).
  Setting ADDR to GND = 1:1:0:0:0:0:0
  Setting ADDR to VIN = 1:1:0:0:1:1:1
  For other values and resistor divider
  setup, see the DS for details.
- Input offset voltage and full-scale gain error are both at theirminimal at a temperature of 30°C.
  Aim to have ambient temperature inside module to be 30°C.
- Resolution of 0.0625°C.
  Look into setting temperature alerts when desired preset temperatures are reached.

### Library data of the parts
C11 C12 = CAP CER 100nF 0805 SMD: as C7#1 on sheet 06_MCU; ComponentLink1Description: Datasheet; ComponentLink1URL: http://datasheets.avx.com/X7RDielectric.pdf
R33 R34 = RES 100 0805 SMD: Resistor; Manufacturer_Part_Number: 1623096-1
TP11-TP14 = TP 1.5mm PAD
U2 = IC TYPE_K AMP I2Q MCP9600-I/MX SMD: MCP9600 Series Thermocouple Electromotive Force to Â±1.5Â°C Converter - VQFN-2; Manufacturer_Part_Number: MCP9600-E/MX; ComponentLink1Description: Datasheet; ComponentLink1URL: https://www.mouser.co.za/datasheet/2/268/MCP960X_L0X_RL0X_Thermocouple_EMF_to_Temperature_C-3443378.pdf

## Sheet 04_Accelerometer.SchDoc
size A4; SheetNumber: 6; SheetTotal: 8
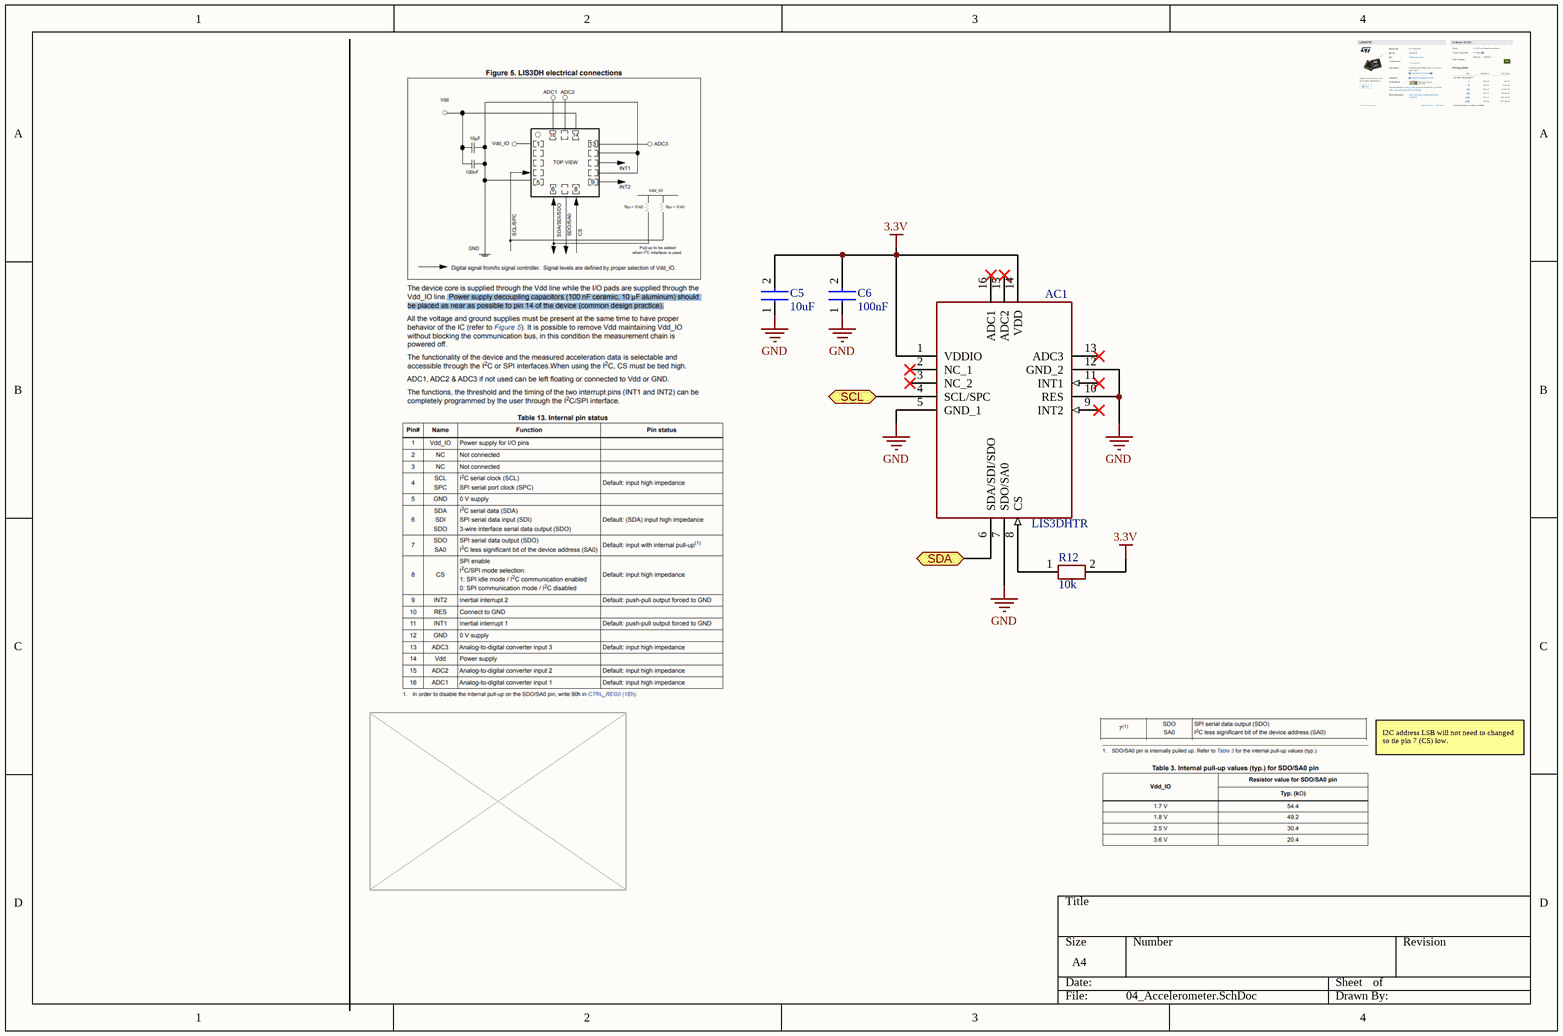
[diagram p5: 04_Accelerometer.SchDoc]

### Parts
(Parts that share a designator on the sheet are numbered #1, #2 ... from top to bottom, then left to right.)
AC1#1  LIS3DHTR  [LIS3DHTR]
C5#1  10uF  [CAPC2012X94N]
C6#1  100nF  [CAPC2012X94N]
R12#1  10k  [RESC2012X60N]

### Ports
SCL (bidir, see 01_Top[2C], 03_Temp_Sensor[4B], 04.2_Thermocouple_Handling_01[2B], 06_MCU[6D]), SDA (bidir, see 01_Top[2C], 03_Temp_Sensor[4B], 04.2_Thermocouple_Handling_01[2B], 06_MCU[6D])

### Nets
3.3V: AC1#1.1(VDDIO) AC1#1.14(VDD) C5#1.2 C6#1.2 R12#1.2
GND: AC1#1.5(GND_1) AC1#1.7(SDO/SA0) AC1#1.10(RES) AC1#1.12(GND_2) C5#1.1 C6#1.1
IO6/SDA: AC1#1.6(SDA/SDI/SDO) ; port SDA
IO7/SCL: AC1#1.4(SCL/SPC) ; port SCL
NetAC1#1_8: AC1#1.8(CS) R12#1.1

Not connected (* = marked no-connect by the designer): AC1#1 2(NC_1)* 3(NC_2)* 9(INT2)* 11(INT1)* 13(ADC3)* 15(ADC2)* 16(ADC1)*

### Notes on the sheet
- I2C address LSB will not need to changed so tie pin 7 (CS) low.

### Library data of the parts
AC1#1 = IC ACC MEMS 3-AXIS 11uA SMD: Accelerometer; Manufacturer_Part_Number: LIS3DHTR; ComponentLink1Description: Datasheet; ComponentLink1URL: https://www.mouser.co.za/datasheet/2/389/lis3dh-1849589.pdf
C5#1 = CAP CER 10uF 0805 SMD: as C10#1 on sheet 06_MCU; ComponentLink1Description: Datasheet; ComponentLink1URL: https://www.mouser.co.za/datasheet/2/585/MLCC-1837944.pdf
C6#1 = CAP CER 100nF 0805 SMD: as C7#1 on sheet 06_MCU; ComponentLink1Description: Datasheet; ComponentLink1URL: http://datasheets.avx.com/X7RDielectric.pdf
R12#1 = RES 10K 0805 SMD: as R26#1 on sheet 06_MCU

## Sheet 02_Power.SchDoc
size A4; SheetNumber: 2; SheetTotal: 8
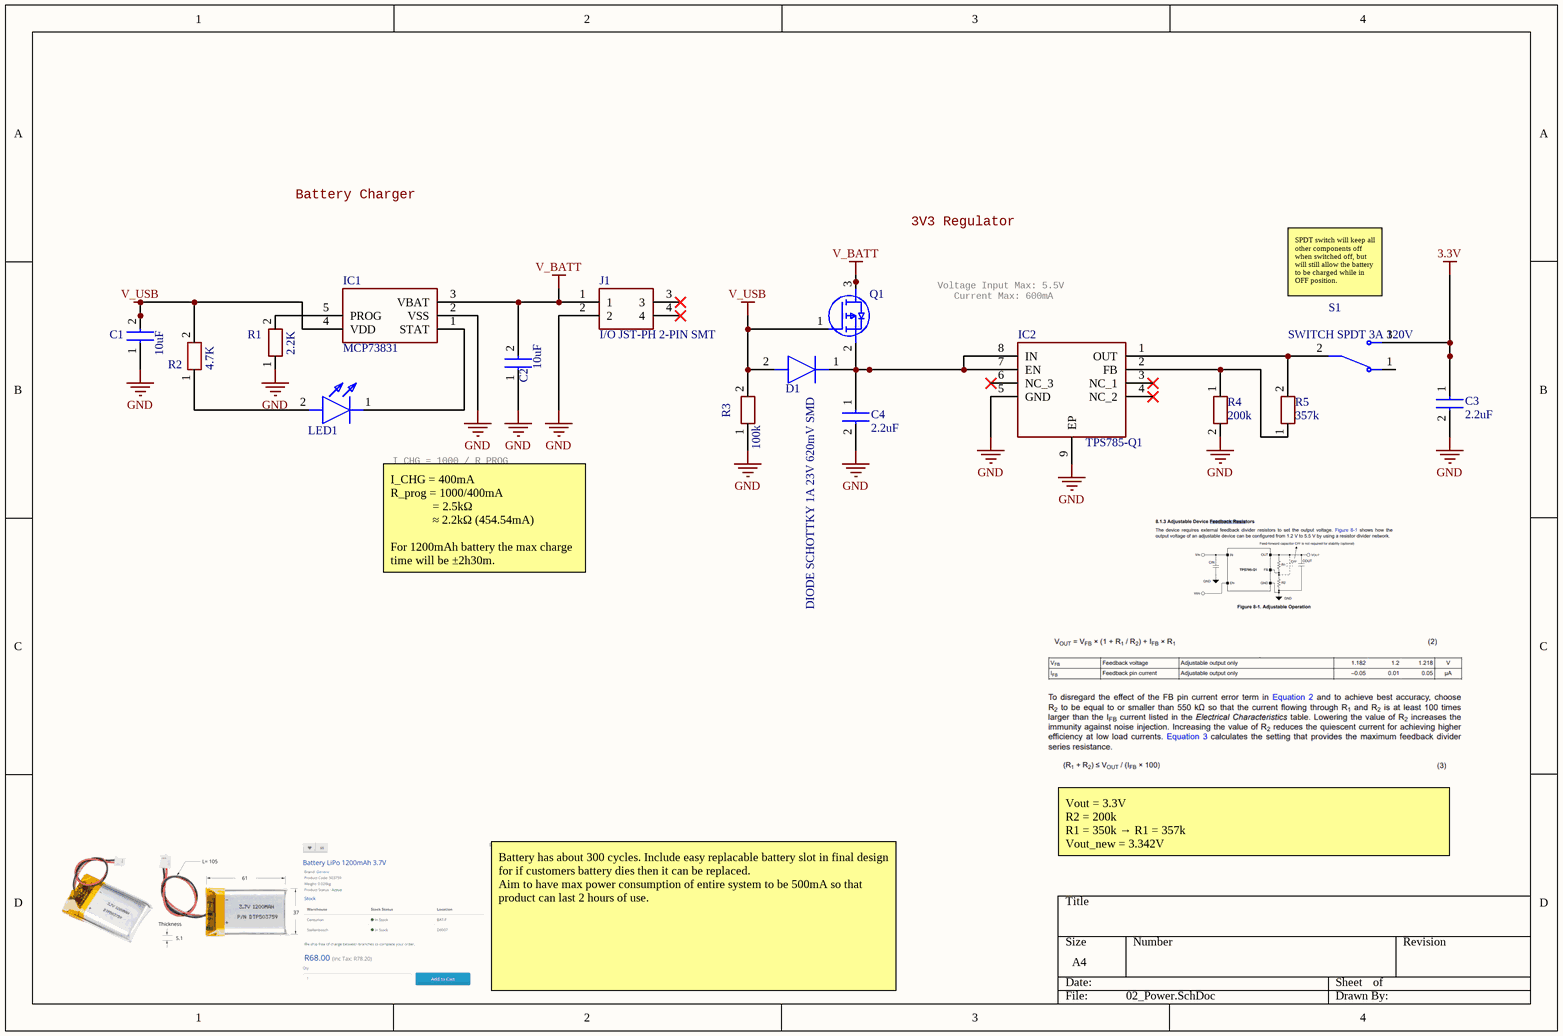
[diagram p6: 02_Power.SchDoc]

### Parts
(Parts that share a designator on the sheet are numbered #1, #2 ... from top to bottom, then left to right.)
C1#1  10uF  [CAPC2012X94N]
C2#1  10uF  [CAPC2012X94N]
C3#1  2.2uF  [CAPC2012X135N]
C4#1  2.2uF  [CAPC2012X135N]
D1#1  DIODE SCHOTTKY 1A 23V 620mV SMD  [SOD2512X113N]
IC1#1  MCP73831  [SOT95P270X145-5N]
IC2#1  TPS785-Q1  [SON65P300X300X100-9N-D]
J1#1  I/O JST-PH 2-PIN SMT  [1769]
LED1#1  LED YELLOW 0805 SMD  [LYM676Q2S126Z]  (value not drawn)
Q1#1  MOSFET P-CH ENH FET -20V 52mOh -5A SMD  [SOT96P240X115-3N]  (value not drawn)
R1#1  2.2K  [RESC2012X70N]
R2#1  4.7K  [RESC2012X50N]
R3#1  100k  [RESC2012X50N]
R4#1  200k  [RESC2012X60N]
R5#1  357k  [ERJ6ENF1000V]
S1#1  SWITCH SPDT 3A 120V  [SW_500ASSP1M6QE]

### Nets
3.3V: C3#1.1 S1#1.3(NO)
GND: C1#1.1 C2#1.1 C3#1.2 C4#1.2 IC1#1.2(VSS) IC2#1.5(GND) IC2#1.9(EP) J1#1.2 R1#1.1 R3#1.1 R4#1.2
V_BATT: C2#1.2 IC1#1.3(VBAT) J1#1.1 Q1#1.3(D)
V_USB: C1#1.2 D1#1.2(A) IC1#1.4(VDD) Q1#1.1(G) R2#1.2 R3#1.2
NetC4#1_1: C4#1.1 D1#1.1(K) IC2#1.7(EN) IC2#1.8(IN) Q1#1.2(S)
NetIC1#1_1: IC1#1.1(STAT) LED1#1.1(K)
NetIC1#1_5: IC1#1.5(PROG) R1#1.2
NetIC2#1_1: IC2#1.1(OUT) R5#1.2 S1#1.2(COM)
NetIC2#1_2: IC2#1.2(FB) R4#1.1 R5#1.1
NetLED1#1_2: LED1#1.2(A) R2#1.1

Not connected (* = marked no-connect by the designer): IC2#1 3(NC_1)* 4(NC_2)* 6(NC_3)*; J1#1 3* 4*; S1#1 1(NC)

### Notes on the sheet
- Battery Charger
- 3V3 Regulator
- Voltage Input Max: 5.5V
  Current Max: 600mA
- (near S1#1) SPDT switch will keep all other components off when switched off, but will still allow the battery to be charged while in OFF position.
- (near LED1#1) I_CHG = 1000 / R_PROG
- I_CHG = 400mA
  R_prog = 1000/400mA
  = 2.5kΩ
  ≈ 2.2kΩ (454.54mA)
  For 1200mAh battery the max charge time will be ±2h30m.
- Vout = 3.3V
  R2 = 200k
  R1 = 350k → R1 = 357k
  Vout_new = 3.342V
- Battery has about 300 cycles. Include easy replacable battery slot in final design for if customers battery dies then it can be replaced.
  Aim to have max power consumption of entire system to be 500mA so that product can last 2 hours of use.

### Library data of the parts
C1#1 C2#1 = CAP CER 10uF 0805 SMD: as C10#1 on sheet 06_MCU; ComponentLink1Description: Datasheet; ComponentLink1URL: https://www.mouser.co.za/datasheet/2/585/MLCC-1837944.pdf
C3#1 C4#1 = CAP CER 2u2F 0805 SMD: as C9#1 on sheet 06_MCU
D1#1 = DIODE SCHOTTKY 1A 23V 620mV SMD: Diode; Manufacturer_Part_Number: BAT20JFILM; ComponentLink1Description: Datasheet; ComponentLink1URL: http://www.st.com/web/en/resource/technical/document/datasheet/CD00012201.pdf
IC1#1 = IC BATT CHG MGNT Li-Po 4V2 REG SMD: Integrated Circuit; Manufacturer_Part_Number: MCP73831T-2ACI/OT; ComponentLink1Description: Datasheet; ComponentLink1URL: http://ww1.microchip.com/downloads/en/DeviceDoc/20001984g.pdf
IC2#1 = IC LDO 1A 5V5 ADJ SMD SON-8: LDO Voltage Regulators Automotive 1-A high -accuracy adjustable; Manufacturer_Part_Number: TPS78501QWDRBRQ1; ComponentLink1Description: Datasheet; ComponentLink1URL: https://www.ti.com/lit/gpn/TPS785-Q1
J1#1 = I/O JST-PH 2-PIN SMT: Connector; Manufacturer_Part_Number: 1769
LED1#1 = LED YELLOW 0805 SMD: Single Colour LED Yellow 20mA; Manufacturer_Part_Number: LY M676-Q2S1-26-Z; ComponentLink1Description: Datasheet; ComponentLink1URL: https://www.mouser.com/datasheet/2/588/Osram_7222021_LY__M676_EN-2891431.pdf
Q1#1 = MOSFET P-CH ENH FET -20V 52mOh -5A SMD: MOSFET (P-Channel); Manufacturer_Part_Number: DMG2305UX-7; ComponentLink1Description: Datasheet; ComponentLink1URL: https://www.diodes.com/assets/Datasheets/DMG2305UX.pdf
R1#1 = RES 2.2K 0805 SMD: as R23#1 on sheet 06_MCU
R2#1 = RES 4.7K 0805 SMD: Resistor; Manufacturer_Part_Number: CRCW08054K70FKEA
R3#1 = RES 100K 0805 SMD: as R21#1 on sheet 06_MCU
R4#1 = RES 200K 0805 SMD: Resistor; Manufacturer_Part_Number: SG73P2ATTD2003F
R5#1 = RES 357K 0805 SMD: Resistor; Manufacturer_Part_Number: ERJ-6ENF3573V; ComponentLink1Description: Datasheet; ComponentLink1URL: https://industrial.panasonic.com/cdbs/www-data/pdf/RDA0000/AOA0000C84.pdf
S1#1 = SWITCH SPDT 3A 120V: Manufacturer_Part_Number: 500ASSP1M6QE

## Sheet 05_Human_Interaction.SchDoc: Test
size A4; Author: Estiaan Botha; DrawnBy: Estiaan Botha; SheetNumber: 7; SheetTotal: 9
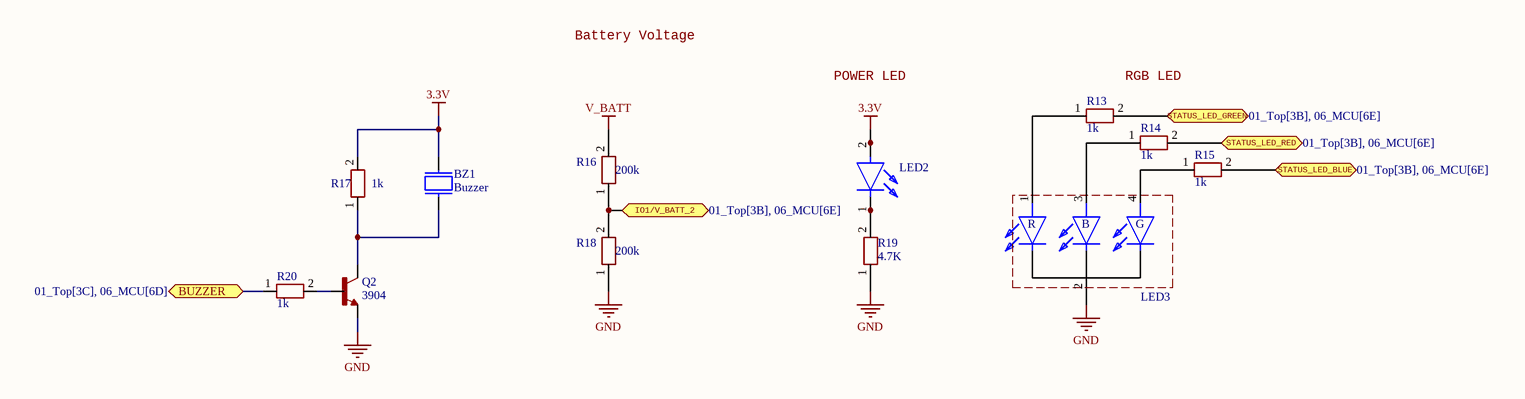
[diagram p7: 05_Human_Interaction.SchDoc]

### Parts
(Parts that share a designator on the sheet are numbered #1, #2 ... from top to bottom, then left to right.)
BZ1#1  Buzzer  [3XDCR_PS1240P02CT3]
LED2#1  LED YELLOW 0805 SMD  [LYM676Q2S126Z]  (value not drawn)
LED3#1  LED RGB THP SRAIGHT-LEG  [LED THP Dialight 521-8559F]  (value not drawn)
Q2#1  3904  [SOT95P230X110-3N]
R13#1  1k  [RESC2012X60N]
R14#1  1k  [RESC2012X60N]
R15#1  1k  [RESC2012X60N]
R16#1  200k  [RESC2012X60N]
R17#1  1k  [RESC2012X60N]
R18#1  200k  [RESC2012X60N]
R19#1  4.7K  [RESC2012X50N]
R20#1  1k  [RESC2012X60N]

### Ports
BUZZER (bidir, see 01_Top[3C], 06_MCU[6D]), IO1/V_BATT_2 (bidir, see 01_Top[3B], 06_MCU[6E]), STATUS_LED_BLUE (bidir, see 01_Top[3B], 06_MCU[6E]), STATUS_LED_GREEN (bidir, see 01_Top[3B], 06_MCU[6E]), STATUS_LED_RED (bidir, see 01_Top[3B], 06_MCU[6E])

### Nets
3.3V: BZ1#1.2 LED2#1.2(A) R17#1.2
GND: LED3#1.2 Q2#1.E R18#1.1 R19#1.1
V_BATT: R16#1.2
IO14: R20#1.1 ; port BUZZER
NetBZ1#1_1: BZ1#1.1 Q2#1.C R17#1.1
NetLED2#1_1: LED2#1.1(K) R19#1.2
NetLED3#1_1: LED3#1.1(K) R13#1.1
NetLED3#1_3: LED3#1.3(K) R14#1.1
NetLED3#1_4: LED3#1.4(K) R15#1.1
NetQ2#1_B: Q2#1.B R20#1.2
NetR13#1_2: R13#1.2 ; port STATUS_LED_GREEN
NetR14#1_2: R14#1.2 ; port STATUS_LED_RED
NetR15#1_2: R15#1.2 ; port STATUS_LED_BLUE
NetR16#1_1: R16#1.1 R18#1.2 ; port IO1/V_BATT_2

### Notes on the sheet
- Battery Voltage
- POWER LED
- (near R13#1) RGB LED
- (in symbol LED RGB THP SRAIGHT-LEG) R; B; G

### Library data of the parts
BZ1#1 = INDICATOR BUZZER PIEZO PS1240P02CT3: Buzzers Transducer, Externally Driven Piezo 3V 4kHz 60dB @ 3V, 10cm Through Hole PC Pins; Manufacturer_Part_Number: PS1240P02CT3; ComponentLink1Description: Datasheet; ComponentLink1URL: https://product.tdk.com/system/files/dam/doc/product/sw_piezo/sw_piezo/piezo-buzzer/catalog/piezoelectronic_buzzer_ps_en.pdf
LED2#1 = LED YELLOW 0805 SMD: as LED1#1 on sheet 02_Power; ComponentLink1Description: Datasheet; ComponentLink1URL: https://www.mouser.com/datasheet/2/588/Osram_7222021_LY__M676_EN-2891431.pdf
LED3#1 = LED RGB THP SRAIGHT-LEG: RGB LED Dialight 521-8559F; Manufacturer_Part_Number: 521-8559F; ComponentLink1Description: Datasheet; ComponentLink1URL: https://www.mouser.co.za/datasheet/2/109/C18455B-1843429.pdf
Q2#1 = BJT NPN 3904 SMD SOT-23: NPN SMALL SIGNAL SURFACE MOUNT TRANSISTOR; Manufacturer_Part_Number: MMBT3904
R13#1 R14#1 R15#1 R17#1 R20#1 = RES 1K 0805 SMD: Resistor; Manufacturer_Part_Number: RC0805JR-071KL
R16#1 R18#1 = RES 200K 0805 SMD: as R4#1 on sheet 02_Power
R19#1 = RES 4.7K 0805 SMD: as R2#1 on sheet 02_Power

## Sheet Schematic.SchDoc
size A3; SheetNumber: 9; SheetTotal: 9
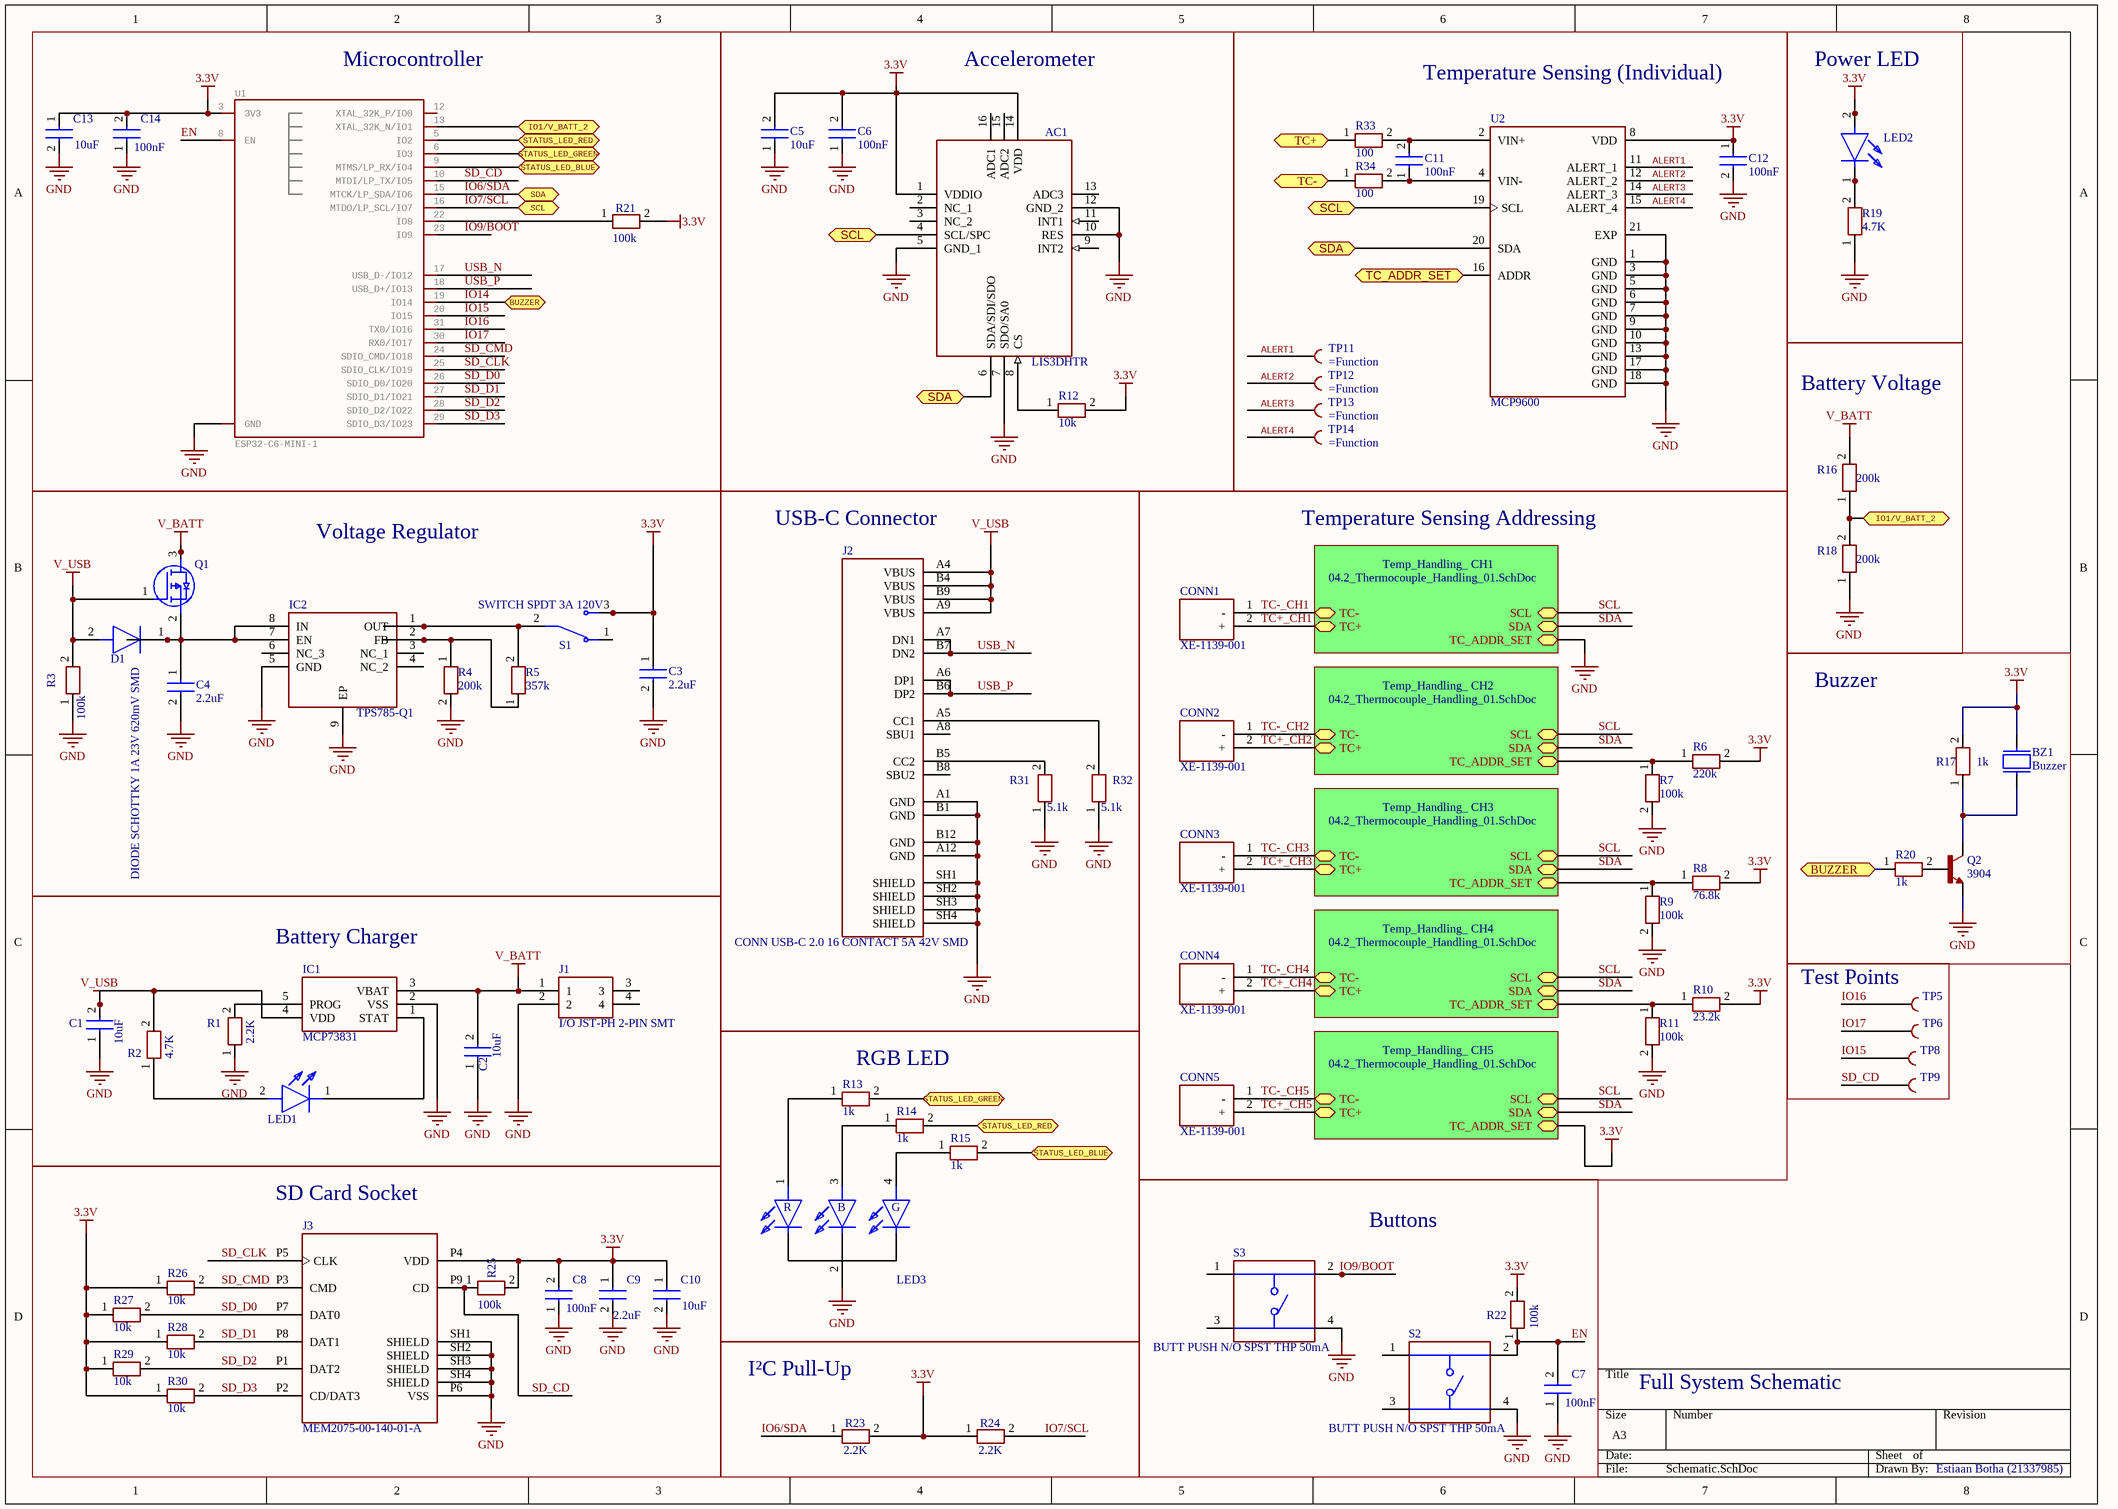
[diagram p8: Schematic.SchDoc]

### Parts
(Parts that share a designator on the sheet are numbered #1, #2 ... from top to bottom, then left to right.)
AC1#2  LIS3DHTR  [LIS3DHTR]
BZ1#2  Buzzer  [3XDCR_PS1240P02CT3]
C1#2  10uF  [CAPC2012X94N]
C2#2  10uF  [CAPC2012X94N]
C3#2  2.2uF  [CAPC2012X135N]
C4#2  2.2uF  [CAPC2012X135N]
C5#2  10uF  [CAPC2012X94N]
C6#2  100nF  [CAPC2012X94N]
C7#2  100nF  [CAPC2012X94N]
C8#2  100nF  [CAPC2012X94N]
C9#2  2.2uF  [CAPC2012X135N]
C10#2  10uF  [CAPC2012X94N]
C11  100nF  [CAPC2012X94N]
C12  100nF  [CAPC2012X94N]
C13#2  10uF  [CAPC2012X94N]
C14#2  100nF  [CAPC2012X94N]
CONN1#2  XE-1139-001  [AM-K PCB XE-1139-001]
CONN2#2  XE-1139-001  [AM-K PCB XE-1139-001]
CONN3#2  XE-1139-001  [AM-K PCB XE-1139-001]
CONN4#2  XE-1139-001  [AM-K PCB XE-1139-001]
CONN5#2  XE-1139-001  [AM-K PCB XE-1139-001]
D1#2  DIODE SCHOTTKY 1A 23V 620mV SMD  [SOD2512X113N]
IC1#2  MCP73831  [SOT95P270X145-5N]
IC2#2  TPS785-Q1  [SON65P300X300X100-9N-D]
J1#2  I/O JST-PH 2-PIN SMT  [1769]
J2#2  CONN USB-C 2.0 16 CONTACT 5A 42V SMD  [CUI_UJ20-C-H-G-SMT-TR]
J3#2  MEM2075-00-140-01-A  [GCT_MEM2075-00-140-01-A]
LED1#2  LED YELLOW 0805 SMD  [LYM676Q2S126Z]  (value not drawn)
LED2#2  LED YELLOW 0805 SMD  [LYM676Q2S126Z]  (value not drawn)
LED3#2  LED RGB THP SRAIGHT-LEG  [LED THP Dialight 521-8559F]  (value not drawn)
Q1#2  MOSFET P-CH ENH FET -20V 52mOh -5A SMD  [SOT96P240X115-3N]  (value not drawn)
Q2#2  3904  [SOT95P230X110-3N]
R1#2  2.2K  [RESC2012X70N]
R2#2  4.7K  [RESC2012X50N]
R3#2  100k  [RESC2012X50N]
R4#2  200k  [RESC2012X60N]
R5#2  357k  [ERJ6ENF1000V]
R6#2  220k  [RESC2012X60N]
R7#2  100k  [RESC2012X50N]
R8#2  76.8k  [RESC2012X60N]
R9#2  100k  [RESC2012X50N]
R10#2  23.2k  [RESC2012X60N]
R11#2  100k  [RESC2012X50N]
R12#2  10k  [RESC2012X60N]
R13#2  1k  [RESC2012X60N]
R14#2  1k  [RESC2012X60N]
R15#2  1k  [RESC2012X60N]
R16#2  200k  [RESC2012X60N]
R17#2  1k  [RESC2012X60N]
R18#2  200k  [RESC2012X60N]
R19#2  4.7K  [RESC2012X50N]
R20#2  1k  [RESC2012X60N]
R21#2  100k  [RESC2012X50N]
R22#2  100k  [RESC2012X50N]
R23#2  2.2K  [RESC2012X70N]
R24#2  2.2K  [RESC2012X70N]
R25#2  100k  [RESC2012X50N]
R26#2  10k  [RESC2012X60N]
R27#2  10k  [RESC2012X60N]
R28#2  10k  [RESC2012X60N]
R29#2  10k  [RESC2012X60N]
R30#2  10k  [RESC2012X60N]
R31#2  5.1k  [RESC2012X60N]
R32#2  5.1k  [RESC2012X60N]
R33  100  [RESC2012X60N]
R34  100  [RESC2012X60N]
S1#2  SWITCH SPDT 3A 120V  [SW_500ASSP1M6QE]
S2#2  BUTT PUSH N/O SPST THP 50mA  [SW_TS02-66-43-BK-100-LCR-D]
S3#2  BUTT PUSH N/O SPST THP 50mA  [SW_TS02-66-43-BK-100-LCR-D]
TP5#2  (no value)  [TP_Pad_TH_1.2P_0.6H]  (no BOM)
TP6#2  (no value)  [TP_Pad_TH_1.2P_0.6H]  (no BOM)
TP8#2  (no value)  [TP_Pad_TH_1.2P_0.6H]  (no BOM)
TP9#2  (no value)  [TP_Pad_TH_1.2P_0.6H]  (no BOM)
TP11  (no value)  [TP_Pad_TH_1.2P_0.6H]  (no BOM)
TP12  (no value)  [TP_Pad_TH_1.2P_0.6H]  (no BOM)
TP13  (no value)  [TP_Pad_TH_1.2P_0.6H]  (no BOM)
TP14  (no value)  [TP_Pad_TH_1.2P_0.6H]  (no BOM)
U1#2  ESP32-C6-MINI-1  [ESP32C6MINI1H8]
U2  MCP9600  [QFN65P500X500X100-21N]

### Blocks framed on the sheet
Microcontroller: C13#2 C14#2 R21#2 U1#2
Accelerometer: AC1#2 C5#2 C6#2 R12#2
Temperature Sensing (Individual): C11 C12 R33 R34 TP11-TP14 U2
Power LED: LED2#2 R19#2
Battery Voltage: R16#2 R18#2
Voltage Regulator: C3#2 C4#2 D1#2 IC2#2 Q1#2 R3#2 R4#2 R5#2 S1#2
USB-C Connector: J2#2 R31#2 R32#2
Temperature Sensing Addressing: CONN1#2 CONN2#2 CONN3#2 CONN4#2 CONN5#2 R6#2 R7#2 R8#2 R9#2 R10#2 R11#2
Buzzer: BZ1#2 Q2#2 R17#2 R20#2
Battery Charger: C1#2 C2#2 IC1#2 J1#2 LED1#2 R1#2 R2#2
Test Points: TP5#2 TP6#2 TP8#2 TP9#2
RGB LED: LED3#2 R13#2 R14#2 R15#2
SD Card Socket: C8#2 C9#2 C10#2 J3#2 R25#2 R26#2 R27#2 R28#2 R29#2 R30#2
Buttons: C7#2 R22#2 S2#2 S3#2
I²C Pull-Up: R23#2 R24#2

### Sub-sheets
Temp_Handling_ CH1 = 04.2_Thermocouple_Handling_01.SchDoc: TC+ (bidir), TC- (bidir), SCL (bidir), SDA (bidir), TC_ADDR_SET (bidir)
Temp_Handling_ CH2 = 04.2_Thermocouple_Handling_01.SchDoc: TC+ (bidir), TC- (bidir), SCL (bidir), SDA (bidir), TC_ADDR_SET (bidir)
Temp_Handling_ CH3 = 04.2_Thermocouple_Handling_01.SchDoc: TC+ (bidir), TC- (bidir), SCL (bidir), SDA (bidir), TC_ADDR_SET (bidir)
Temp_Handling_ CH4 = 04.2_Thermocouple_Handling_01.SchDoc: TC+ (bidir), TC- (bidir), SCL (bidir), SDA (bidir), TC_ADDR_SET (bidir)
Temp_Handling_ CH5 = 04.2_Thermocouple_Handling_01.SchDoc: TC+ (bidir), TC- (bidir), SCL (bidir), SDA (bidir), TC_ADDR_SET (bidir)

### Ports
BUZZER (bidir, see 01_Top[3C], 05_Human_Interaction[1C]), BUZZER (bidir, see 01_Top[3C], 06_MCU[6D]), IO1/V_BATT_2 (bidir, see 01_Top[3B], 05_Human_Interaction[2B]), IO1/V_BATT_2 (bidir, see 01_Top[3B], 06_MCU[6E]), SCL (bidir, see 01_Top[2C], 03_Temp_Sensor[4B], 04.2_Thermocouple_Handling_01[2B], 04_Accelerometer[3B]), SCL (bidir, see 01_Top[2C], 03_Temp_Sensor[4B], 04.2_Thermocouple_Handling_01[2B], 06_MCU[6D]), SCL (bidir, see 03_Temp_Sensor[2B], 03_Temp_Sensor[4B], 04_Accelerometer[3B], 06_MCU[6D]), SDA (bidir, see 01_Top[2C], 03_Temp_Sensor[4B], 04.2_Thermocouple_Handling_01[2B], 04_Accelerometer[3C]), SDA (bidir, see 01_Top[2C], 03_Temp_Sensor[4B], 04.2_Thermocouple_Handling_01[2B], 06_MCU[6D]), SDA (bidir, see 03_Temp_Sensor[2B], 03_Temp_Sensor[4B], 04_Accelerometer[3C], 06_MCU[6D]), STATUS_LED_BLUE (bidir, see 01_Top[3B], 05_Human_Interaction[4B]), STATUS_LED_BLUE (bidir, see 01_Top[3B], 06_MCU[6E]), STATUS_LED_GREEN (bidir, see 01_Top[3B], 05_Human_Interaction[4B]), STATUS_LED_GREEN (bidir, see 01_Top[3B], 06_MCU[6E]), STATUS_LED_RED (bidir, see 01_Top[3B], 05_Human_Interaction[4B]), STATUS_LED_RED (bidir, see 01_Top[3B], 06_MCU[6E]), TC+ (bidir, see 03_Temp_Sensor[2B]), TC- (bidir, see 03_Temp_Sensor[2B]), TC_ADDR_SET (bidir, see 03_Temp_Sensor[2B])

### Nets
3.3V: AC1#2.1(VDDIO) AC1#2.14(VDD) BZ1#2.2 C3#2.1 C5#2.2 C6#2.2 C8#2.2 C9#2.1 C10#2.1 C12.1 C13#2.1 C14#2.2 J3#2.P4(VDD) LED2#2.2(A) R6#2.2 R8#2.2 R10#2.2 R12#2.2 R17#2.2 R21#2.2 R22#2.2 R23#2.2 R24#2.1 R25#2.2 R26#2.1 R27#2.1 R28#2.1 R29#2.1 R30#2.1 S1#2.3(NO) U1#2.3(3V3) U2.8(VDD) ; sheet Temp_Handling_ CH5/TC_ADDR_SET
GND: AC1#2.5(GND_1) AC1#2.7(SDO/SA0) AC1#2.10(RES) AC1#2.12(GND_2) C1#2.1 C2#2.1 C3#2.2 C4#2.2 C5#2.1 C6#2.1 C7#2.1 C8#2.1 C9#2.2 C10#2.2 C12.2 C13#2.2 C14#2.1 IC1#2.2(VSS) IC2#2.5(GND) IC2#2.9(EP) J1#2.2 J2#2.A1(GND) J2#2.A12(GND) J2#2.B1(GND) J2#2.B12(GND) J2#2.SH1(SHIELD) J2#2.SH2(SHIELD) J2#2.SH3(SHIELD) J2#2.SH4(SHIELD) J3#2.P6(VSS) J3#2.SH1(SHIELD) J3#2.SH2(SHIELD) J3#2.SH3(SHIELD) J3#2.SH4(SHIELD) LED3#2.2 Q2#2.E R1#2.1 R3#2.1 R4#2.2 R7#2.2 R9#2.2 R11#2.2 R18#2.1 R19#2.1 R31#2.1 R32#2.1 S2#2.4 S3#2.4 U1#2.1(GND) U2.1(GND) U2.3(GND) U2.5(GND) U2.6(GND) U2.7(GND) U2.9(GND) U2.10(GND) U2.13(GND) U2.17(GND) U2.18(GND) U2.21(EXP) ; sheet Temp_Handling_ CH1/TC_ADDR_SET
V_BATT: C2#2.2 IC1#2.3(VBAT) J1#2.1 Q1#2.3(D) R16#2.2
V_USB: C1#2.2 D1#2.2(A) IC1#2.4(VDD) J2#2.A4(VBUS) J2#2.A9(VBUS) J2#2.B4(VBUS) J2#2.B9(VBUS) Q1#2.1(G) R2#2.2 R3#2.2
ALERT1: TP11.TP U2.11(ALERT_1)
ALERT2: TP12.TP U2.12(ALERT_2)
ALERT3: TP13.TP U2.14(ALERT_3)
ALERT4: TP14.TP U2.15(ALERT_4)
EN: C7#2.2 R22#2.1 S2#2.2 U1#2.8(EN)
IO6/SDA: AC1#2.6(SDA/SDI/SDO) R23#2.1 U1#2.15(MTCK/LP_SDA/IO6) U2.20(SDA) ; port SDA
IO7/SCL: AC1#2.4(SCL/SPC) R24#2.2 U1#2.16(MTDO/LP_SCL/IO7) U2.19(SCL) ; port SCL
IO9/BOOT: S3#2.2 U1#2.23(IO9)
IO14: R20#2.1 U1#2.19(IO14) ; port BUZZER
IO15: TP8#2.TP U1#2.20(IO15)
IO16: TP5#2.TP U1#2.31(TX0/IO16)
IO17: TP6#2.TP U1#2.30(RX0/IO17)
SCL: sheet Temp_Handling_ CH1/SCL, sheet Temp_Handling_ CH2/SCL, sheet Temp_Handling_ CH3/SCL, sheet Temp_Handling_ CH4/SCL, sheet Temp_Handling_ CH5/SCL
SD_CD: J3#2.P9(CD) R25#2.1 TP9#2.TP U1#2.10(MTDI/LP_TX/IO5)
SD_CLK: J3#2.P5(CLK) U1#2.25(SDIO_CLK/IO19)
SD_CMD: J3#2.P3(CMD) R26#2.2 U1#2.24(SDIO_CMD/IO18)
SD_D0: J3#2.P7(DAT0) R27#2.2 U1#2.26(SDIO_D0/IO20)
SD_D1: J3#2.P8(DAT1) R28#2.2 U1#2.27(SDIO_D1/IO21)
SD_D2: J3#2.P1(DAT2) R29#2.2 U1#2.28(SDIO_D2/IO22)
SD_D3: J3#2.P2(CD/DAT3) R30#2.2 U1#2.29(SDIO_D3/IO23)
SDA: sheet Temp_Handling_ CH1/SDA, sheet Temp_Handling_ CH2/SDA, sheet Temp_Handling_ CH3/SDA, sheet Temp_Handling_ CH4/SDA, sheet Temp_Handling_ CH5/SDA
TC+_CH1: CONN1#2.2(+) ; sheet Temp_Handling_ CH1/TC+
TC+_CH2: CONN2#2.2(+) ; sheet Temp_Handling_ CH2/TC+
TC+_CH3: CONN3#2.2(+) ; sheet Temp_Handling_ CH3/TC+
TC+_CH4: CONN4#2.2(+) ; sheet Temp_Handling_ CH4/TC+
TC+_CH5: CONN5#2.2(+) ; sheet Temp_Handling_ CH5/TC+
TC-_CH1: CONN1#2.1(-) ; sheet Temp_Handling_ CH1/TC-
TC-_CH2: CONN2#2.1(-) ; sheet Temp_Handling_ CH2/TC-
TC-_CH3: CONN3#2.1(-) ; sheet Temp_Handling_ CH3/TC-
TC-_CH4: CONN4#2.1(-) ; sheet Temp_Handling_ CH4/TC-
TC-_CH5: CONN5#2.1(-) ; sheet Temp_Handling_ CH5/TC-
USB_N: J2#2.A7(DN1) J2#2.B7(DN2) U1#2.17(USB_D-/IO12)
USB_P: J2#2.A6(DP1) J2#2.B6(DP2) U1#2.18(USB_D+/IO13)
NetAC1#2_8: AC1#2.8(CS) R12#2.1
NetBZ1#2_1: BZ1#2.1 Q2#2.C R17#2.1
NetC4#2_1: C4#2.1 D1#2.1(K) IC2#2.7(EN) IC2#2.8(IN) Q1#2.2(S)
NetC11_1: C11.1 R34.2 U2.4(VIN-)
NetC11_2: C11.2 R33.2 U2.2(VIN+)
NetIC1#2_1: IC1#2.1(STAT) LED1#2.1(K)
NetIC1#2_5: IC1#2.5(PROG) R1#2.2
NetIC2#2_1: IC2#2.1(OUT) R5#2.2 S1#2.2(COM)
NetIC2#2_2: IC2#2.2(FB) R4#2.1 R5#2.1
NetJ2#2_A5: J2#2.A5(CC1) R32#2.2
NetJ2#2_B5: J2#2.B5(CC2) R31#2.2
NetLED1#2_2: LED1#2.2(A) R2#2.1
NetLED2#2_1: LED2#2.1(K) R19#2.2
NetLED3#2_1: LED3#2.1(K) R13#2.1
NetLED3#2_3: LED3#2.3(K) R14#2.1
NetLED3#2_4: LED3#2.4(K) R15#2.1
NetQ2#2_B: Q2#2.B R20#2.2
NetR6#2_1: R6#2.1 R7#2.1 ; sheet Temp_Handling_ CH2/TC_ADDR_SET
NetR8#2_1: R8#2.1 R9#2.1 ; sheet Temp_Handling_ CH3/TC_ADDR_SET
NetR10#2_1: R10#2.1 R11#2.1 ; sheet Temp_Handling_ CH4/TC_ADDR_SET
NetR13#2_2: R13#2.2 U1#2.6(IO3) ; port STATUS_LED_GREEN
NetR14#2_2: R14#2.2 U1#2.5(IO2) ; port STATUS_LED_RED
NetR15#2_2: R15#2.2 U1#2.9(MTMS/LP_RX/IO4) ; port STATUS_LED_BLUE
NetR16#2_1: R16#2.1 R18#2.2 U1#2.13(XTAL_32K_N/IO1) ; port IO1/V_BATT_2
NetR21#2_1: R21#2.1 U1#2.22(IO8)
NetR33_1: R33.1 ; port TC+
NetR34_1: R34.1 ; port TC-
NetU2_16: U2.16(ADDR) ; port TC_ADDR_SET

Not connected (* = marked no-connect by the designer): AC1#2 2(NC_1) 3(NC_2) 9(INT2) 11(INT1) 13(ADC3) 15(ADC2) 16(ADC1); IC2#2 3(NC_1) 4(NC_2) 6(NC_3); J1#2 3 4; J2#2 A8(SBU1) B8(SBU2); S1#2 1(NC); S2#2 1 3; S3#2 1 3; U1#2 12(XTAL_32K_P/IO0)

### Notes on the sheet
- Full System Schematic
- Estiaan Botha (21337985)
- (in symbol LED RGB THP SRAIGHT-LEG) R; B; G

### Library data of the parts
AC1#2 = IC ACC MEMS 3-AXIS 11uA SMD: Accelerometer; Manufacturer_Part_Number: LIS3DHTR; ComponentLink1Description: Datasheet; ComponentLink1URL: https://www.mouser.co.za/datasheet/2/389/lis3dh-1849589.pdf
BZ1#2 = INDICATOR BUZZER PIEZO PS1240P02CT3: as BZ1#1 on sheet 05_Human_Interaction; Manufacturer_Part_Number: PS1240P02CT3; ComponentLink1Description: Datasheet; ComponentLink1URL: https://product.tdk.com/system/files/dam/doc/product/sw_piezo/sw_piezo/piezo-buzzer/catalog/piezoelectronic_buzzer_ps_en.pdf
C1#2 C2#2 C5#2 C10#2 C13#2 = CAP CER 10uF 0805 SMD: as C10#1 on sheet 06_MCU; ComponentLink1Description: Datasheet; ComponentLink1URL: https://www.mouser.co.za/datasheet/2/585/MLCC-1837944.pdf
C3#2 C4#2 C9#2 = CAP CER 2u2F 0805 SMD: as C9#1 on sheet 06_MCU
C6#2 C7#2 C8#2 C11 C12 C14#2 = CAP CER 100nF 0805 SMD: as C7#1 on sheet 06_MCU; ComponentLink1Description: Datasheet; ComponentLink1URL: http://datasheets.avx.com/X7RDielectric.pdf
CONN1#2 CONN2#2 CONN3#2 CONN4#2 CONN5#2 = CONN AM-K-PCB XE-1139-001: Thermocouple Type-K Connector; Manufacturer_Part_Number: XE-1139-001; Supplier: DigiKey; ComponentLink1Description: Datasheet; ComponentLink1URL: https://mm.digikey.com/Volume0/opasdata/d220001/medias/docus/6465/XE-1139-001.pdf
D1#2 = DIODE SCHOTTKY 1A 23V 620mV SMD: as D1#1 on sheet 02_Power; ComponentLink1Description: Datasheet; ComponentLink1URL: http://www.st.com/web/en/resource/technical/document/datasheet/CD00012201.pdf
IC1#2 = IC BATT CHG MGNT Li-Po 4V2 REG SMD: as IC1#1 on sheet 02_Power; ComponentLink1Description: Datasheet; ComponentLink1URL: http://ww1.microchip.com/downloads/en/DeviceDoc/20001984g.pdf
IC2#2 = IC LDO 1A 5V5 ADJ SMD SON-8: as IC2#1 on sheet 02_Power; ComponentLink1Description: Datasheet; ComponentLink1URL: https://www.ti.com/lit/gpn/TPS785-Q1
J1#2 = I/O JST-PH 2-PIN SMT: Connector; Manufacturer_Part_Number: 1769
J2#2 = CONN USB-C 2.0 16 CONTACT 5A 42V SMD: as J2#1 on sheet 06_MCU; ComponentLink1Description: Datasheet; ComponentLink1URL: https://www.sameskydevices.com/product/resource/uj20-c-h-g-smt-tr.pdf
J3#2 = SD CARD SOCKET SMD MEM2075-00-140-01-A: as J3#1 on sheet 06_MCU; ComponentLink1Description: Datasheet; ComponentLink1URL: https://www.mouser.co.za/datasheet/2/837/MEM2075-2887971.pdf; Manufacturer_Part_Number: MEM2075-00-140-01-A
LED1#2 LED2#2 = LED YELLOW 0805 SMD: as LED1#1 on sheet 02_Power; ComponentLink1Description: Datasheet; ComponentLink1URL: https://www.mouser.com/datasheet/2/588/Osram_7222021_LY__M676_EN-2891431.pdf
LED3#2 = LED RGB THP SRAIGHT-LEG: RGB LED Dialight 521-8559F; Manufacturer_Part_Number: 521-8559F; ComponentLink1Description: Datasheet; ComponentLink1URL: https://www.mouser.co.za/datasheet/2/109/C18455B-1843429.pdf
Q1#2 = MOSFET P-CH ENH FET -20V 52mOh -5A SMD: as Q1#1 on sheet 02_Power; ComponentLink1Description: Datasheet; ComponentLink1URL: https://www.diodes.com/assets/Datasheets/DMG2305UX.pdf
Q2#2 = BJT NPN 3904 SMD SOT-23: as Q2#1 on sheet 05_Human_Interaction
R1#2 R23#2 R24#2 = RES 2.2K 0805 SMD: as R23#1 on sheet 06_MCU
R2#2 R19#2 = RES 4.7K 0805 SMD: as R2#1 on sheet 02_Power
R3#2 R7#2 R9#2 R11#2 R21#2 R22#2 R25#2 = RES 100K 0805 SMD: as R21#1 on sheet 06_MCU
R4#2 R16#2 R18#2 = RES 200K 0805 SMD: as R4#1 on sheet 02_Power
R5#2 = RES 357K 0805 SMD: as R5#1 on sheet 02_Power; ComponentLink1Description: Datasheet; ComponentLink1URL: https://industrial.panasonic.com/cdbs/www-data/pdf/RDA0000/AOA0000C84.pdf
R6#2 = RES 220K 0805 SMD: as R6#1 on sheet 03_Temp_Sensor
R8#2 = RES 76.8K 0805 SMD: as R8#1 on sheet 03_Temp_Sensor; ComponentLink1Description: Datasheet; ComponentLink1URL: https://industrial.panasonic.com/cdbs/www-data/pdf/RDA0000/AOA0000C84.pdf
R10#2 = RES 23.2K 0805 SMD: as R10#1 on sheet 03_Temp_Sensor; ComponentLink1Description: Datasheet; ComponentLink1URL: https://industrial.panasonic.com/cdbs/www-data/pdf/RDA0000/AOA0000C84.pdf
R12#2 R26#2 R27#2 R28#2 R29#2 R30#2 = RES 10K 0805 SMD: as R26#1 on sheet 06_MCU
R13#2 R14#2 R15#2 R17#2 R20#2 = RES 1K 0805 SMD: as R13#1 on sheet 05_Human_Interaction
R31#2 R32#2 = RES 5.1K 0805 SMD: as R31#1 on sheet 06_MCU; ComponentLink1Description: Datasheet; ComponentLink1URL: https://industrial.panasonic.com/cdbs/www-data/pdf/RDA0000/AOA0000C84.pdf
R33 R34 = RES 100 0805 SMD: as R33 on sheet 04.2_Thermocouple_Handling_01
S1#2 = SWITCH SPDT 3A 120V: Manufacturer_Part_Number: 500ASSP1M6QE
S2#2 S3#2 = BUTT PUSH N/O SPST THP 50mA: as S2#1 on sheet 06_MCU
TP5#2 TP6#2 TP8#2 TP9#2 TP11-TP14 = TP 1.5mm PAD
U1#2 = ESP32-C6-MINI-1: as U1#1 on sheet 06_MCU; ComponentLink1Description: Datasheet; ComponentLink1URL: https://www.mouser.com/catalog/specsheets/Espressif_Systems_esp32-c6-mini-1_mini-1u_datasheet_en.pdf?_gl=1*7278yr*_gcl_aw*R0NMLjE3Mzk0MzM2MTQuQ2p3S0NBaUFxckc5QmhBVkVpd0FhUHU1emlsTWRuRXdaa2Fsd2VWNEN5MzNjMjVBX1BkRDhocTJZbnRtek0tckw4Q0pVVXJTcmNRbGdob0NCcXNRQXZEX0J3RQ..*_gcl_au*ODgyNzE3NTQxLjE3NDEwOTkzMzU.*_ga*MjEzMDEzNzc2Mi4xNzMzMzA0NDkw*_ga_15W4STQT4T*MTc0MTUxNTkxNS42MC4xLjE3NDE1MTgwNDEuMzcuMC4w
U2 = IC TYPE_K AMP I2Q MCP9600-I/MX SMD: as U2 on sheet 04.2_Thermocouple_Handling_01; ComponentLink1Description: Datasheet; ComponentLink1URL: https://www.mouser.co.za/datasheet/2/268/MCP960X_L0X_RL0X_Thermocouple_EMF_to_Temperature_C-3443378.pdf